# Altium project SPICEBot.PrjPcb
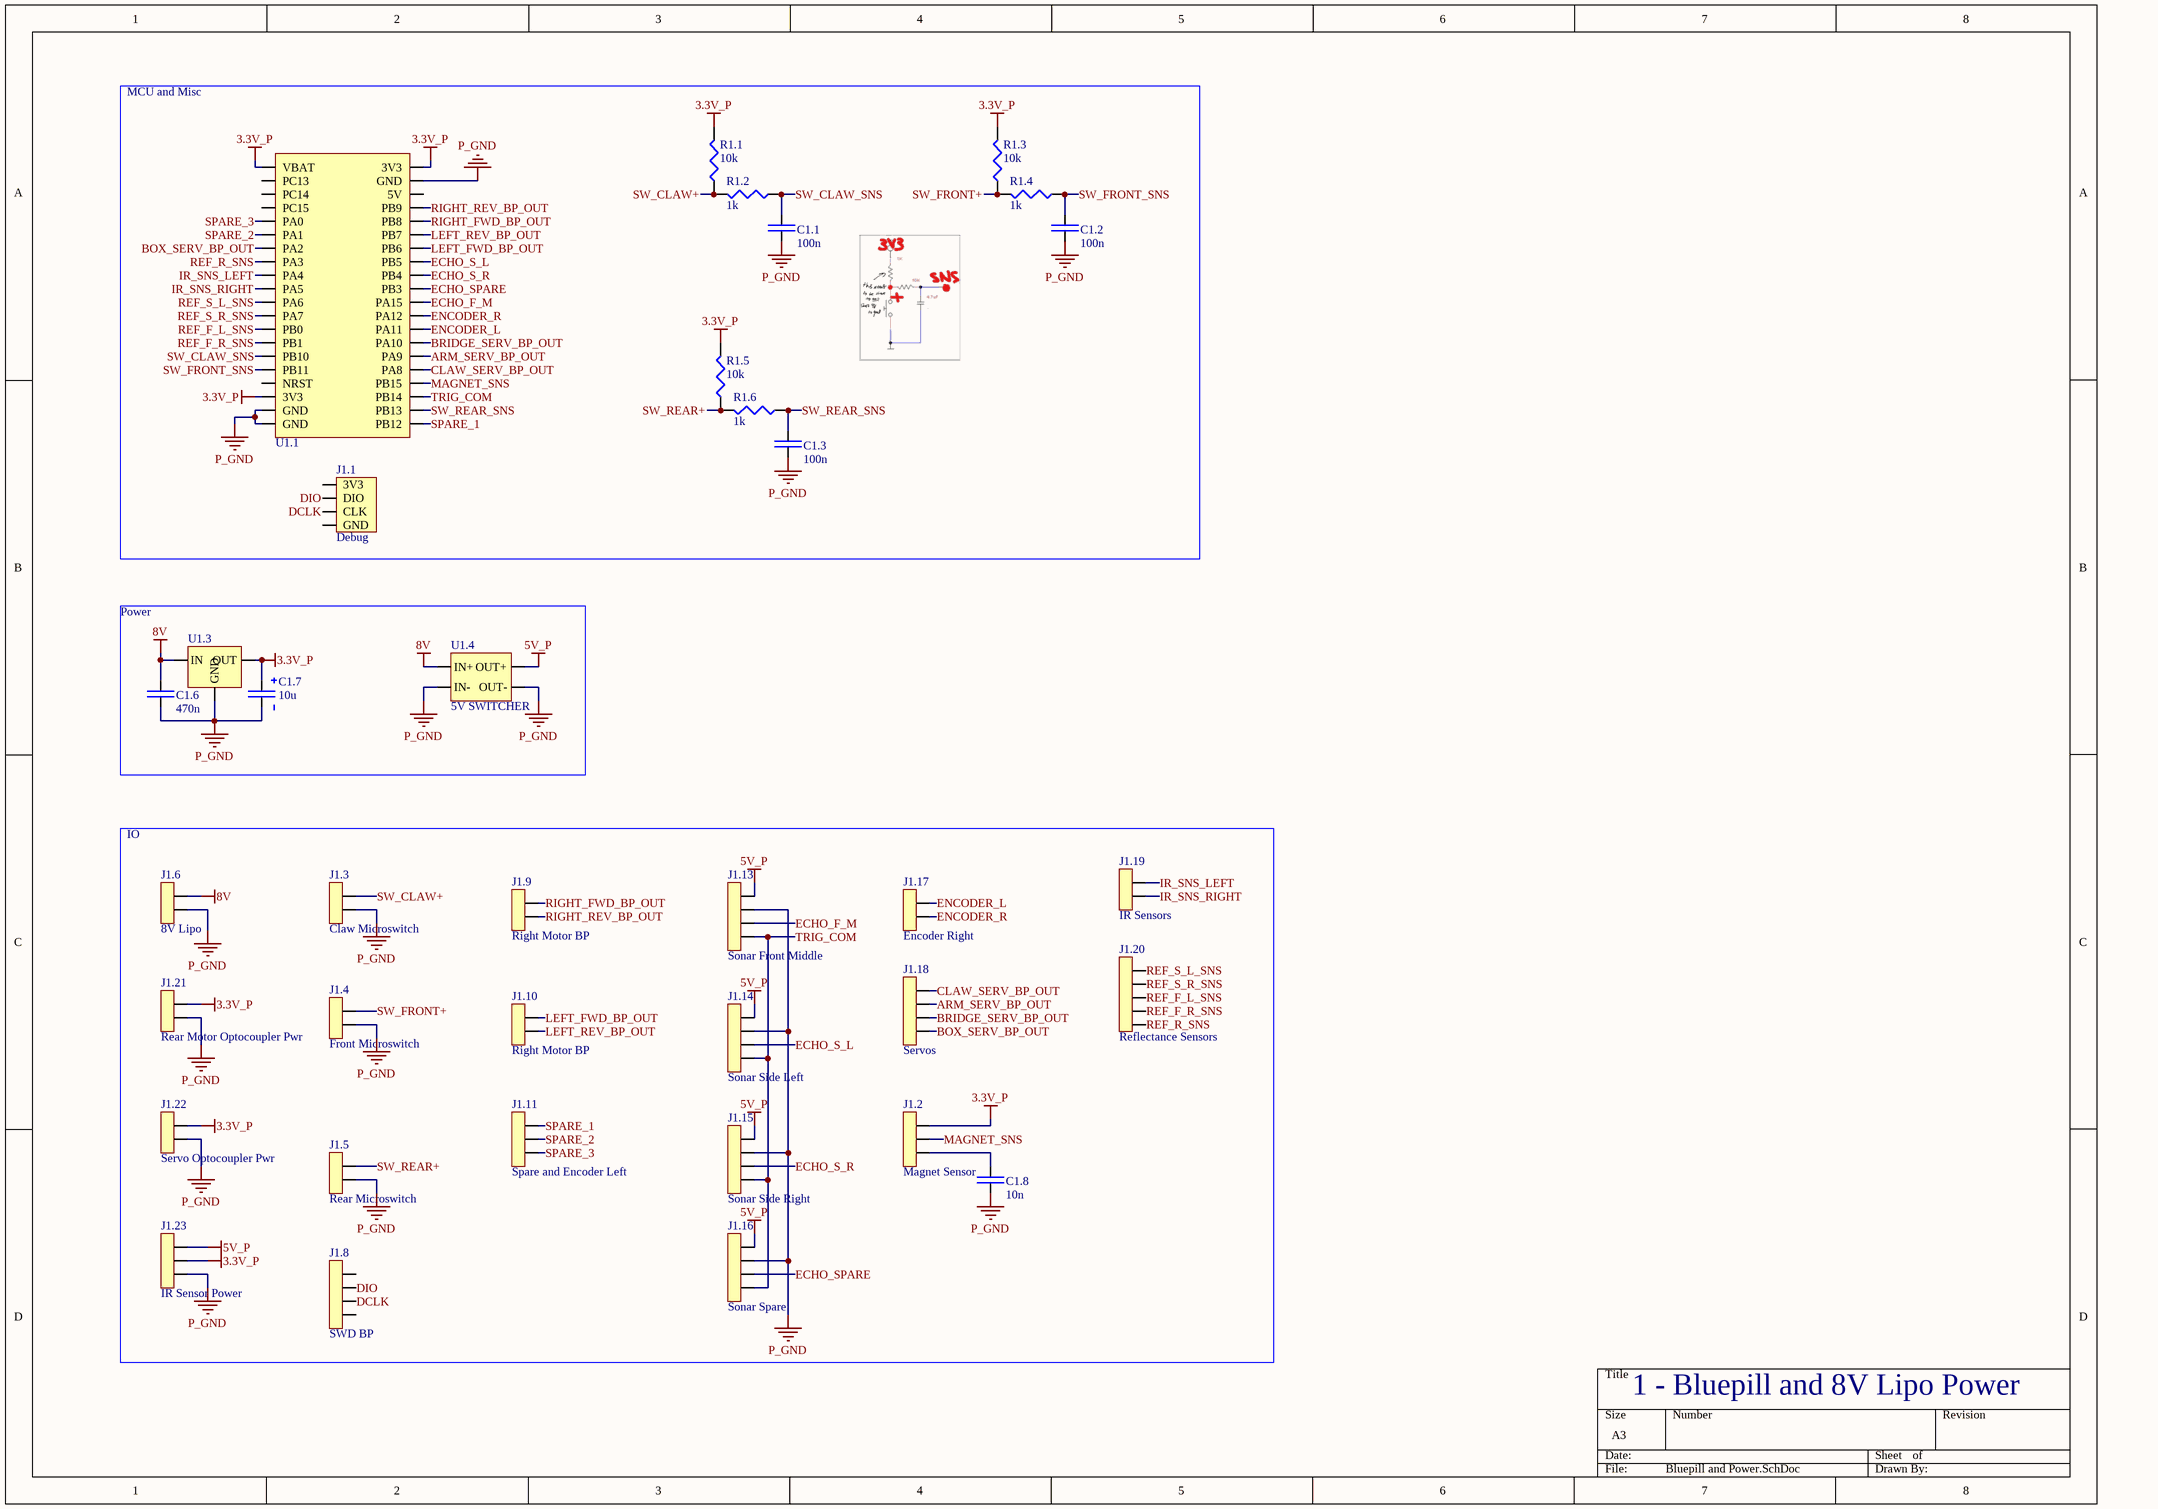
[diagram p0: Bluepill and Power.SchDoc]
9 sheets, 224 parts. Net scope: global (net labels, ports and power ports of the same name join across sheets).
Board files: BP.PcbDoc, IR Sensors.PcbDoc, Reflectance.PcbDoc, Rear Motors.PcbDoc, Servos.PcbDoc, Reflectance (Single).PcbDoc, Gate Driver Chip.PcbDoc, Motor Driver (Single).PcbDoc
Sheets:
  Bluepill and Power.SchDoc
  IR.SchDoc
  Reflectance.SchDoc
  Rear Motors.SchDoc
  Servos.SchDoc
  Reflectance (Single).SchDoc
  Gate Driver Chip.SchDoc
  Motor Driver (Single).SchDoc
  Servo Opto.SchDoc

## Sheet Bluepill and Power.SchDoc
size A3; SheetNumber: 1; SheetTotal: 9

### Parts
C1.1  100n  [Non Polarized Cap]
C1.2  100n  [Non Polarized Cap]
C1.3  100n  [Non Polarized Cap]
C1.6  470n  [Non Polarized Cap]
C1.7  10u  [Polarized Cap]
C1.8  10n  [Non Polarized Cap]
J1.1  Debug  [Four Pads]
J1.2  Magnet Sensor  [3pos JST]
J1.3  Claw Microswitch  [2pos JST]
J1.4  Front Microswitch  [2pos JST]
J1.5  Rear Microswitch  [2pos JST]
J1.6  8V Lipo  [2pos JST]
J1.8  SWD BP  [4Pos JST]
J1.9  Right Motor BP  [2pos JST]
J1.10  Right Motor BP  [2pos JST]
J1.11  Spare and Encoder Left  [3pos JST]
J1.13  Sonar Front Middle  [4Pos JST]
J1.14  Sonar Side Left  [4Pos JST]
J1.15  Sonar Side Right  [4Pos JST]
J1.16  Sonar Spare  [4Pos JST]
J1.17  Encoder Right  [2pos JST]
J1.18  Servos  [4Pos JST]
J1.19  IR Sensors  [2pos JST]
J1.20  Reflectance Sensors  [5POS JST]
J1.21  Rear Motor Optocoupler Pwr  [2pos JST]
J1.22  Servo Optocoupler Pwr  [2pos JST]
J1.23  IR Sensor Power  [3pos JST]
R1.1  10k  [Res_Generic]
R1.2  1k  [Res_Generic]
R1.3  10k  [Res_Generic]
R1.4  1k  [Res_Generic]
R1.5  10k  [Res_Generic]
R1.6  1k  [Res_Generic]
U1.1  Bluepill  [DIP40]  (value not drawn)
U1.3  3.3V  [TO220]  (value not drawn)
U1.4  5V SWITCHER  [ADJ Switcher]

### Blocks framed on the sheet
MCU and Misc: C1.1-C1.3 J1.1 R1.1-R1.6 U1.1
Power: C1.6 C1.7 U1.3 U1.4
IO: C1.8 J1.2-J1.6 J1.8-J1.11 J1.13-J1.23

### Nets
3.3V_P: C1.7.1 J1.2.3 J1.21.2 J1.22.2 J1.23.2 R1.1.2 R1.3.2 R1.5.2 U1.1.1(VBAT) U1.1.18(3V3) U1.1.40(3V3) U1.3.2(OUT)
5V_P: J1.13.4 J1.14.4 J1.15.4 J1.16.4 J1.23.3 U1.4.4(OUT+)
8V: C1.6.2 J1.6.2 U1.3.3(IN) U1.4.1(IN+)
P_GND: C1.1.1 C1.2.1 C1.3.1 C1.6.1 C1.7.2 C1.8.1 J1.3.1 J1.4.1 J1.5.1 J1.6.1 J1.13.3 J1.14.3 J1.15.3 J1.16.3 J1.21.1 J1.22.1 J1.23.1 U1.1.19(GND) U1.1.20(GND) U1.1.39(GND) U1.3.1(GND) U1.4.2(IN-) U1.4.3(OUT-)
ARM_SERV_BP_OUT: J1.18.3 U1.1.26(PA9)
BOX_SERV_BP_OUT: J1.18.1 U1.1.7(PA2)
BRIDGE_SERV_BP_OUT: J1.18.2 U1.1.27(PA10)
CLAW_SERV_BP_OUT: J1.18.4 U1.1.25(PA8)
DCLK: J1.1.3(CLK) J1.8.2
DIO: J1.1.2(DIO) J1.8.3
ECHO_F_M: J1.13.2 U1.1.30(PA15)
ECHO_S_L: J1.14.2 U1.1.33(PB5)
ECHO_S_R: J1.15.2 U1.1.32(PB4)
ECHO_SPARE: J1.16.2 U1.1.31(PB3)
ENCODER_L: J1.17.2 U1.1.28(PA11)
ENCODER_R: J1.17.1 U1.1.29(PA12)
IR_SNS_LEFT: J1.19.2 U1.1.9(PA4)
IR_SNS_RIGHT: J1.19.1 U1.1.10(PA5)
LEFT_FWD_BP_OUT: J1.10.2 U1.1.34(PB6)
LEFT_REV_BP_OUT: J1.10.1 U1.1.35(PB7)
MAGNET_SNS: J1.2.2 U1.1.24(PB15)
REF_F_L_SNS: J1.20.2 U1.1.13(PB0)
REF_F_R_SNS: J1.20.1 U1.1.14(PB1)
REF_R_SNS: J1.20.5 U1.1.8(PA3)
REF_S_L_SNS: J1.20.4 U1.1.11(PA6)
REF_S_R_SNS: J1.20.3 U1.1.12(PA7)
RIGHT_FWD_BP_OUT: J1.9.2 U1.1.36(PB8)
RIGHT_REV_BP_OUT: J1.9.1 U1.1.37(PB9)
SPARE_1: J1.11.3 U1.1.21(PB12)
SPARE_2: J1.11.2 U1.1.6(PA1)
SPARE_3: J1.11.1 U1.1.5(PA0)
SW_CLAW+: J1.3.2 R1.1.1 R1.2.2
SW_CLAW_SNS: C1.1.2 R1.2.1 U1.1.15(PB10)
SW_FRONT+: J1.4.2 R1.3.1 R1.4.2
SW_FRONT_SNS: C1.2.2 R1.4.1 U1.1.16(PB11)
SW_REAR+: J1.5.2 R1.5.1 R1.6.2
SW_REAR_SNS: C1.3.2 R1.6.1 U1.1.22(PB13)
TRIG_COM: J1.13.1 J1.14.1 J1.15.1 J1.16.1 U1.1.23(PB14)
NetC1.8_2: C1.8.2 J1.2.1

Not connected (* = marked no-connect by the designer): J1.1 1(3V3) 4(GND); J1.8 1 4; U1.1 2(PC13) 3(PC14) 4(PC15) 17(NRST) 38(5V)

### Notes on the sheet
- 1 - Bluepill and 8V Lipo Power

### Library data of the parts
C1.1-C1.3 C1.6 C1.8 = Cap_Generic
C1.7 = Polarized Cap
J1.1 = BP SWD Conn
J1.2 J1.11 J1.23 = 3pos Conn
J1.3-J1.6 J1.9 J1.10 J1.17 J1.19 J1.21 J1.22 = 2pos Conn: 2pos Conn JST
J1.8 J1.13-J1.16 J1.18 = 4pos Conn
J1.20 = 5pos Conn: 5pos Conn JST
R1.1-R1.6 = Res_Generic
U1.1 = Bluepill: STM32F103C8T6
U1.3 = MC33269 3.3V Reg: MC33269 IC REG LINEAR 3.3V 800MA TO220-3; Supplier 1: Mouser; Supplier Part Number 1: 595-UA78M33CKCS
U1.4 = LM2596S: Adjutable Switcher 3.5A Max

## Sheet IR.SchDoc
size A3; SheetNumber: 2; SheetTotal: 8
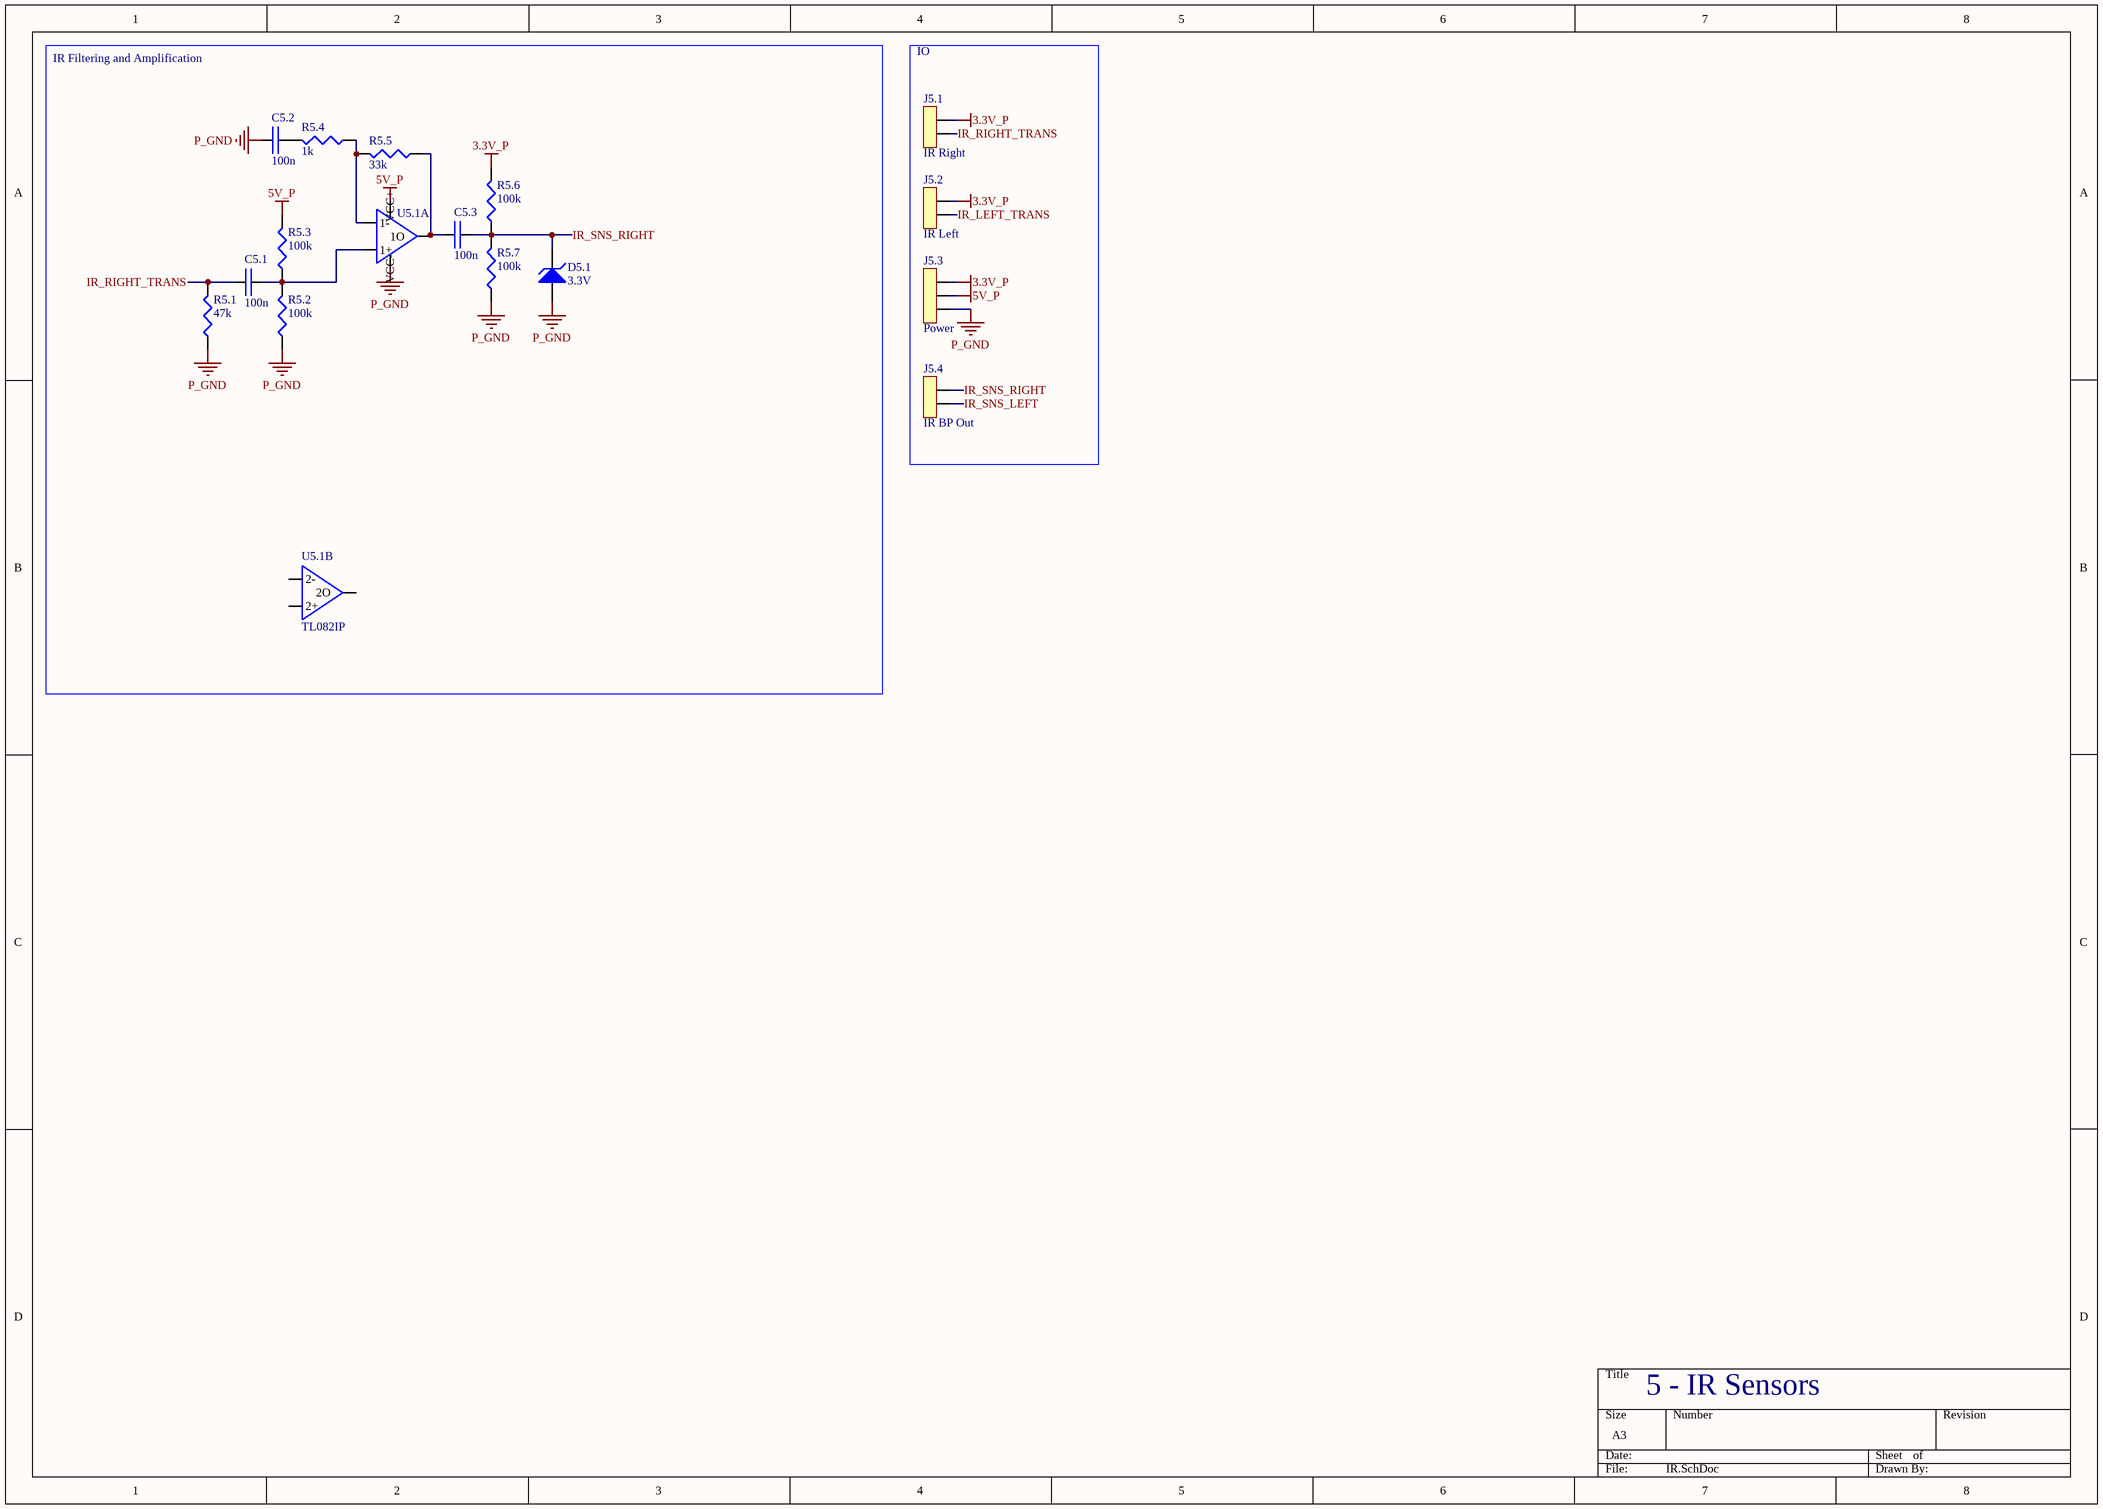
[diagram p1: IR.SchDoc]

### Parts
C5.1  100n  [Non Polarized Cap]
C5.2  100n  [Non Polarized Cap]
C5.3  100n  [Non Polarized Cap]
D5.1  3.3V  [Zener Generic]
J5.1  IR Right  [2pos JST]
J5.2  IR Left  [2pos JST]
J5.3  Power  [3pos JST]
J5.4  IR BP Out  [2pos JST]
R5.1  47k  [Res_Generic]
R5.2  100k  [Res_Generic]
R5.3  100k  [Res_Generic]
R5.4  1k  [Res_Generic]
R5.5  33k  [Res_Generic]
R5.6  100k  [Res_Generic]
R5.7  100k  [Res_Generic]
U5.1  TL082IP  [DIP8]  (value not drawn)  (parts A,B of 2)

### Blocks framed on the sheet
IR Filtering and Amplification: C5.1-C5.3 D5.1 R5.1-R5.7 U5.1
IO: J5.1-J5.4

### Nets
3.3V_P: J5.1.2 J5.2.2 J5.3.3 R5.6.2
5V_P: J5.3.2 R5.3.2 U5.1.8(VCC+)
P_GND: C5.2.1 D5.1.1(Anode) J5.3.1 R5.1.1 R5.2.1 R5.7.1 U5.1.4(VCC-)
IR_LEFT_TRANS: J5.2.1
IR_RIGHT_TRANS: C5.1.1 J5.1.1 R5.1.2
IR_SNS_LEFT: J5.4.1
IR_SNS_RIGHT: C5.3.2 D5.1.2(Cathode) J5.4.2 R5.6.1 R5.7.2
NetC5.1_2: C5.1.2 R5.2.2 R5.3.1 U5.1.3(1+)
NetC5.2_2: C5.2.2 R5.4.2
NetC5.3_1: C5.3.1 R5.5.1 U5.1.1(1O)
NetR5.4_1: R5.4.1 R5.5.2 U5.1.2(1-)

Not connected (* = marked no-connect by the designer): U5.1 5(2+) 6(2-) 7(2O)

### Notes on the sheet
- 5 - IR Sensors

### Library data of the parts
C5.1-C5.3 = Cap_Generic
D5.1 = Zener_Generic
J5.1 J5.2 J5.4 = 2pos Conn: 2pos Conn JST
J5.3 = 3pos Conn
R5.1-R5.7 = Res_Generic
U5.1 = TL082IP Op Amp: TL082IP IC OPAMP JFET 2 CIRCUIT 8DIP; Supplier 1: Mouser; Supplier Part Number 1: 595-TL082IP

## Sheet Reflectance.SchDoc
size A3; SheetNumber: 3; SheetTotal: 9
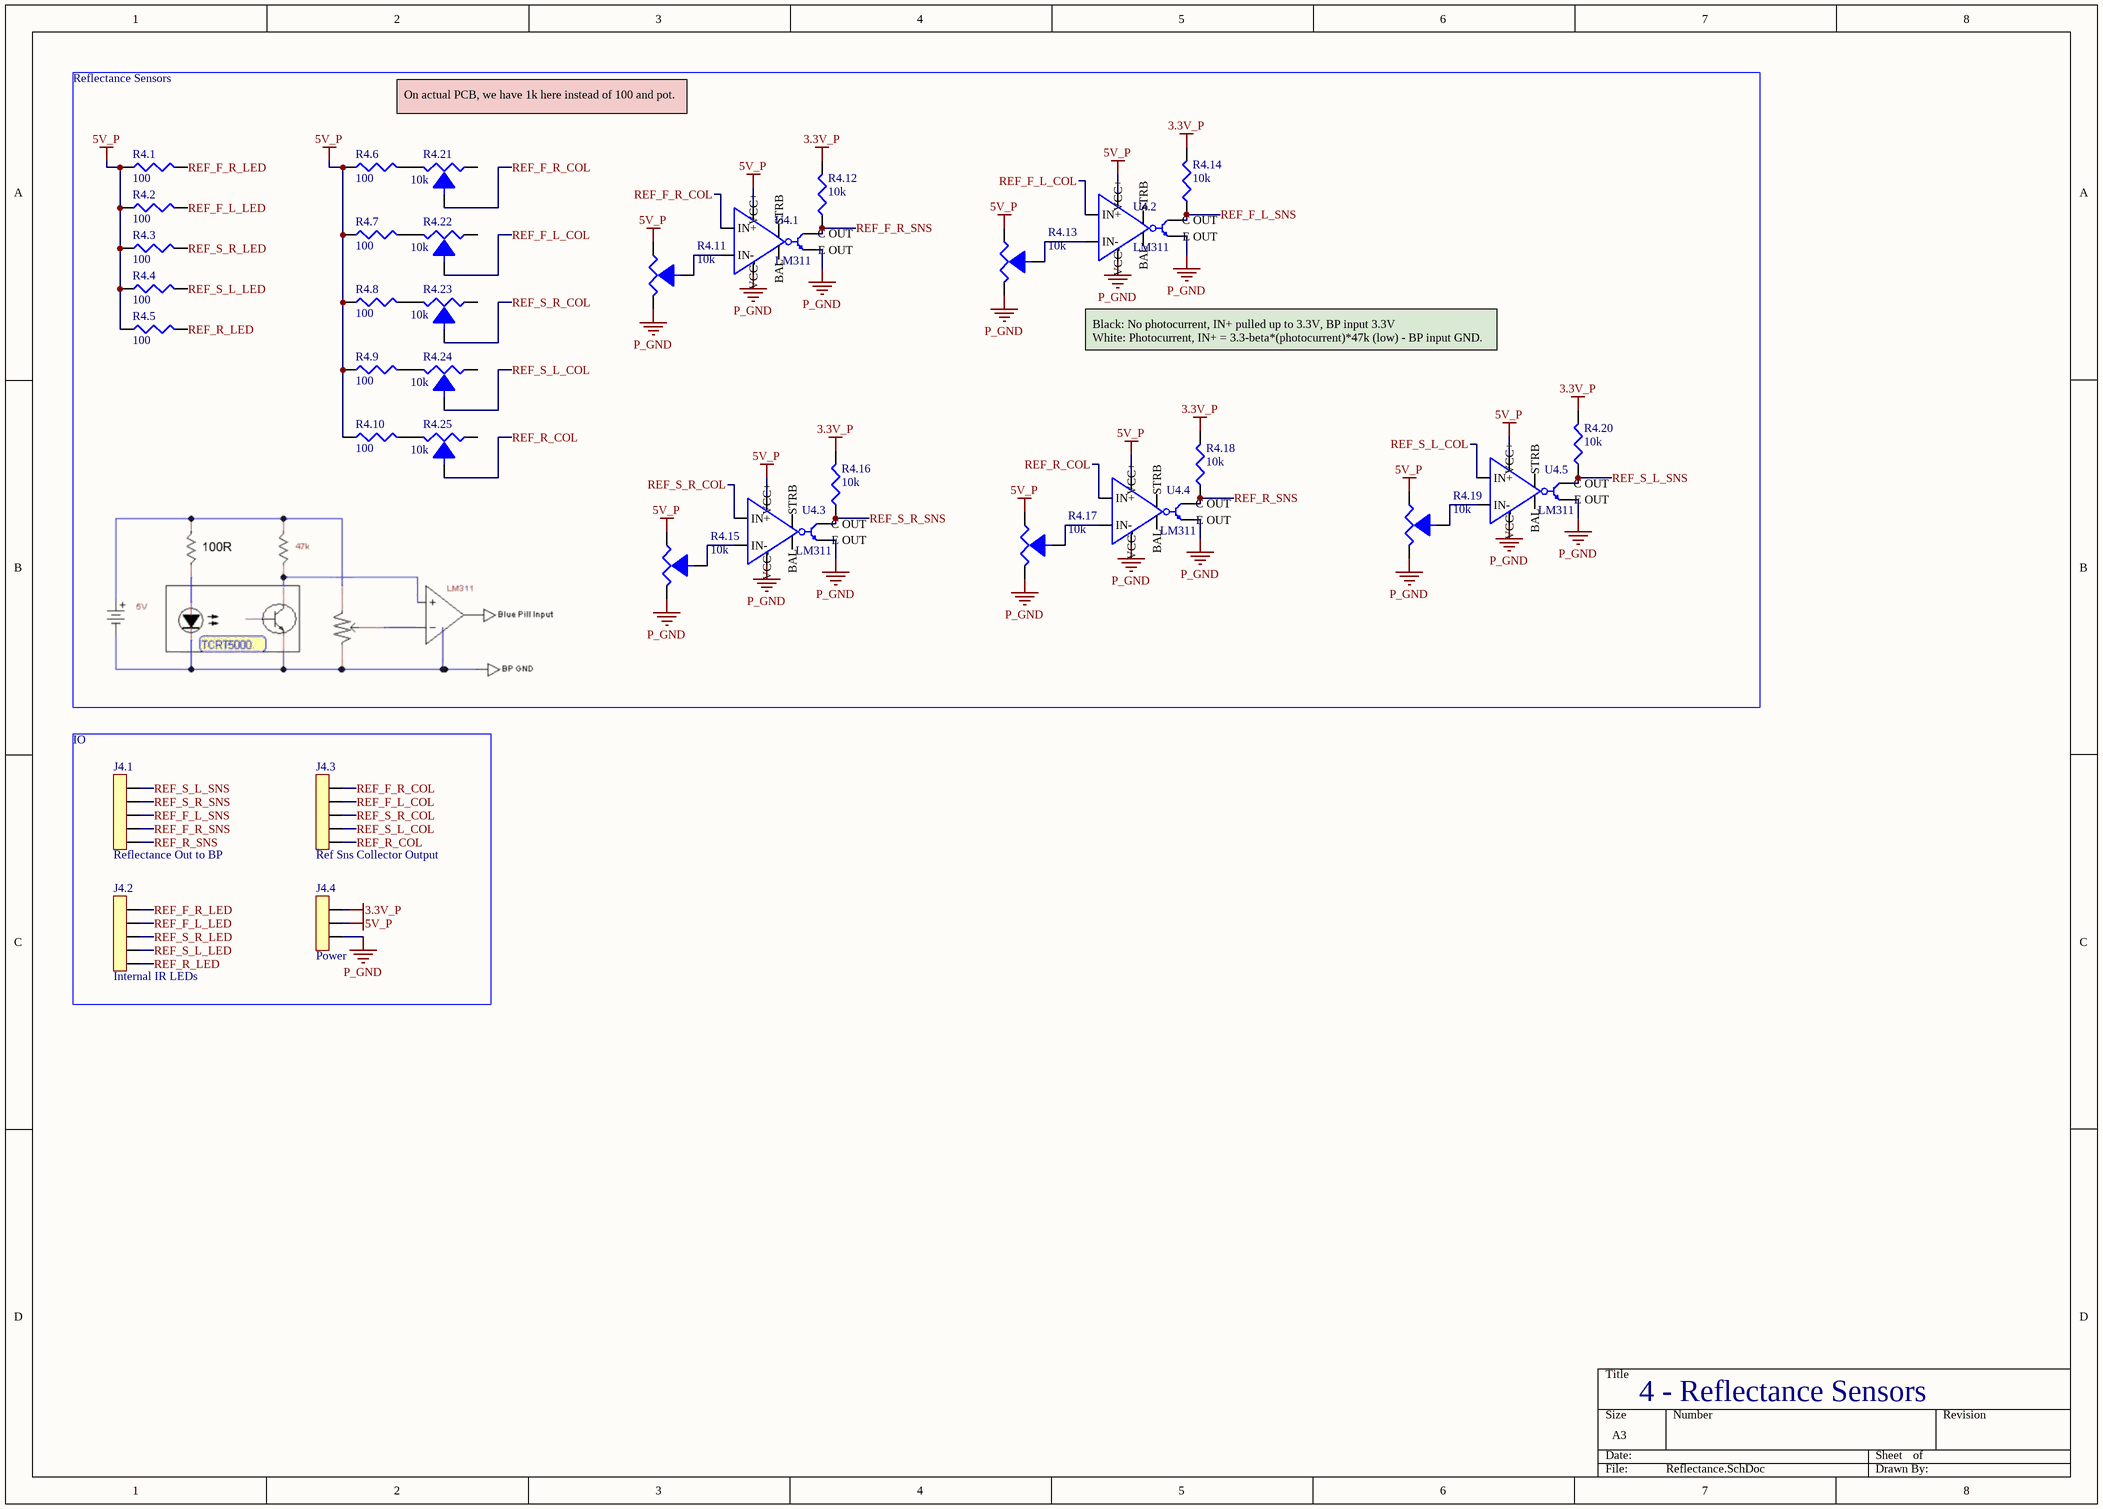
[diagram p2: Reflectance.SchDoc]

### Parts
J4.1  Reflectance Out to BP  [5POS JST]
J4.2  Internal IR LEDs  [5POS JST]
J4.3  Ref Sns Collector Output  [5POS JST]
J4.4  Power  [3pos JST]
R4.1  100  [Res_Generic]
R4.2  100  [Res_Generic]
R4.3  100  [Res_Generic]
R4.4  100  [Res_Generic]
R4.5  100  [Res_Generic]
R4.6  100  [Res_Generic]
R4.7  100  [Res_Generic]
R4.8  100  [Res_Generic]
R4.9  100  [Res_Generic]
R4.10  100  [Res_Generic]
R4.11  10k  [Pot Generic]
R4.12  10k  [Res_Generic]
R4.13  10k  [Pot Generic]
R4.14  10k  [Res_Generic]
R4.15  10k  [Pot Generic]
R4.16  10k  [Res_Generic]
R4.17  10k  [Pot Generic]
R4.18  10k  [Res_Generic]
R4.19  10k  [Pot Generic]
R4.20  10k  [Res_Generic]
R4.21  10k  [Pot Generic]
R4.22  10k  [Pot Generic]
R4.23  10k  [Pot Generic]
R4.24  10k  [Pot Generic]
R4.25  10k  [Pot Generic]
U4.1  LM311  [DIP8]
U4.2  LM311  [DIP8]
U4.3  LM311  [DIP8]
U4.4  LM311  [DIP8]
U4.5  LM311  [DIP8]

### Blocks framed on the sheet
Reflectance Sensors: R4.1-R4.25 U4.1-U4.5
IO: J4.1-J4.4

### Nets
3.3V_P: J4.4.3 R4.12.2 R4.14.2 R4.16.2 R4.18.2 R4.20.2
5V_P: J4.4.2 R4.1.1 R4.2.1 R4.3.1 R4.4.1 R4.5.1 R4.6.1 R4.7.1 R4.8.1 R4.9.1 R4.10.1 R4.11.3 R4.13.3 R4.15.3 R4.17.3 R4.19.3 U4.1.8(VCC+) U4.2.8(VCC+) U4.3.8(VCC+) U4.4.8(VCC+) U4.5.8(VCC+)
P_GND: J4.4.1 R4.11.1 R4.13.1 R4.15.1 R4.17.1 R4.19.1 U4.1.1(E_OUT) U4.1.4(VCC-) U4.2.1(E_OUT) U4.2.4(VCC-) U4.3.1(E_OUT) U4.3.4(VCC-) U4.4.1(E_OUT) U4.4.4(VCC-) U4.5.1(E_OUT) U4.5.4(VCC-)
REF_F_L_COL: J4.3.3 R4.22.2 U4.2.2(IN+)
REF_F_L_LED: J4.2.3 R4.2.2
REF_F_L_SNS: J4.1.2 R4.14.1 U4.2.7(C_OUT)
REF_F_R_COL: J4.3.4 R4.21.2 U4.1.2(IN+)
REF_F_R_LED: J4.2.4 R4.1.2
REF_F_R_SNS: J4.1.1 R4.12.1 U4.1.7(C_OUT)
REF_R_COL: J4.3.5 R4.25.2 U4.4.2(IN+)
REF_R_LED: J4.2.5 R4.5.2
REF_R_SNS: J4.1.5 R4.18.1 U4.4.7(C_OUT)
REF_S_L_COL: J4.3.1 R4.24.2 U4.5.2(IN+)
REF_S_L_LED: J4.2.1 R4.4.2
REF_S_L_SNS: J4.1.4 R4.20.1 U4.5.7(C_OUT)
REF_S_R_COL: J4.3.2 R4.23.2 U4.3.2(IN+)
REF_S_R_LED: J4.2.2 R4.3.2
REF_S_R_SNS: J4.1.3 R4.16.1 U4.3.7(C_OUT)
NetR4.6_2: R4.6.2 R4.21.1
NetR4.7_2: R4.7.2 R4.22.1
NetR4.8_2: R4.8.2 R4.23.1
NetR4.9_2: R4.9.2 R4.24.1
NetR4.10_2: R4.10.2 R4.25.1
NetR4.11_2: R4.11.2 U4.1.3(IN-)
NetR4.13_2: R4.13.2 U4.2.3(IN-)
NetR4.15_2: R4.15.2 U4.3.3(IN-)
NetR4.17_2: R4.17.2 U4.4.3(IN-)
NetR4.19_2: R4.19.2 U4.5.3(IN-)

Not connected (* = marked no-connect by the designer): R4.21 3; R4.22 3; R4.23 3; R4.24 3; R4.25 3; U4.1 5(BAL) 6(STRB); U4.2 5(BAL) 6(STRB); U4.3 5(BAL) 6(STRB); U4.4 5(BAL) 6(STRB); U4.5 5(BAL) 6(STRB)

### Notes on the sheet
- On actual PCB, we have 1k here instead of 100 and pot.
- Black: No photocurrent, IN+ pulled up to 3.3V, BP input 3.3V
  White: Photocurrent, IN+ = 3.3-beta*(photocurrent)*47k (low) - BP input GND.
- 4 - Reflectance Sensors

### Library data of the parts
J4.1-J4.3 = 5pos Conn: 5pos Conn JST
J4.4 = 3pos Conn
R4.1-R4.10 R4.12 R4.14 R4.16 R4.18 R4.20 = Res_Generic
R4.11 R4.13 R4.15 R4.17 R4.19 R4.21-R4.25 = Pot_Generic
U4.1-U4.5 = LM311 Comparator: LM311 IC DIFF COMPARATOR STROBE 8-DIP; Supplier 1: Mouser; Supplier Part Number 1: 595-LM311P

## Sheet Rear Motors.SchDoc
size A3; SheetNumber: 4; SheetTotal: 8
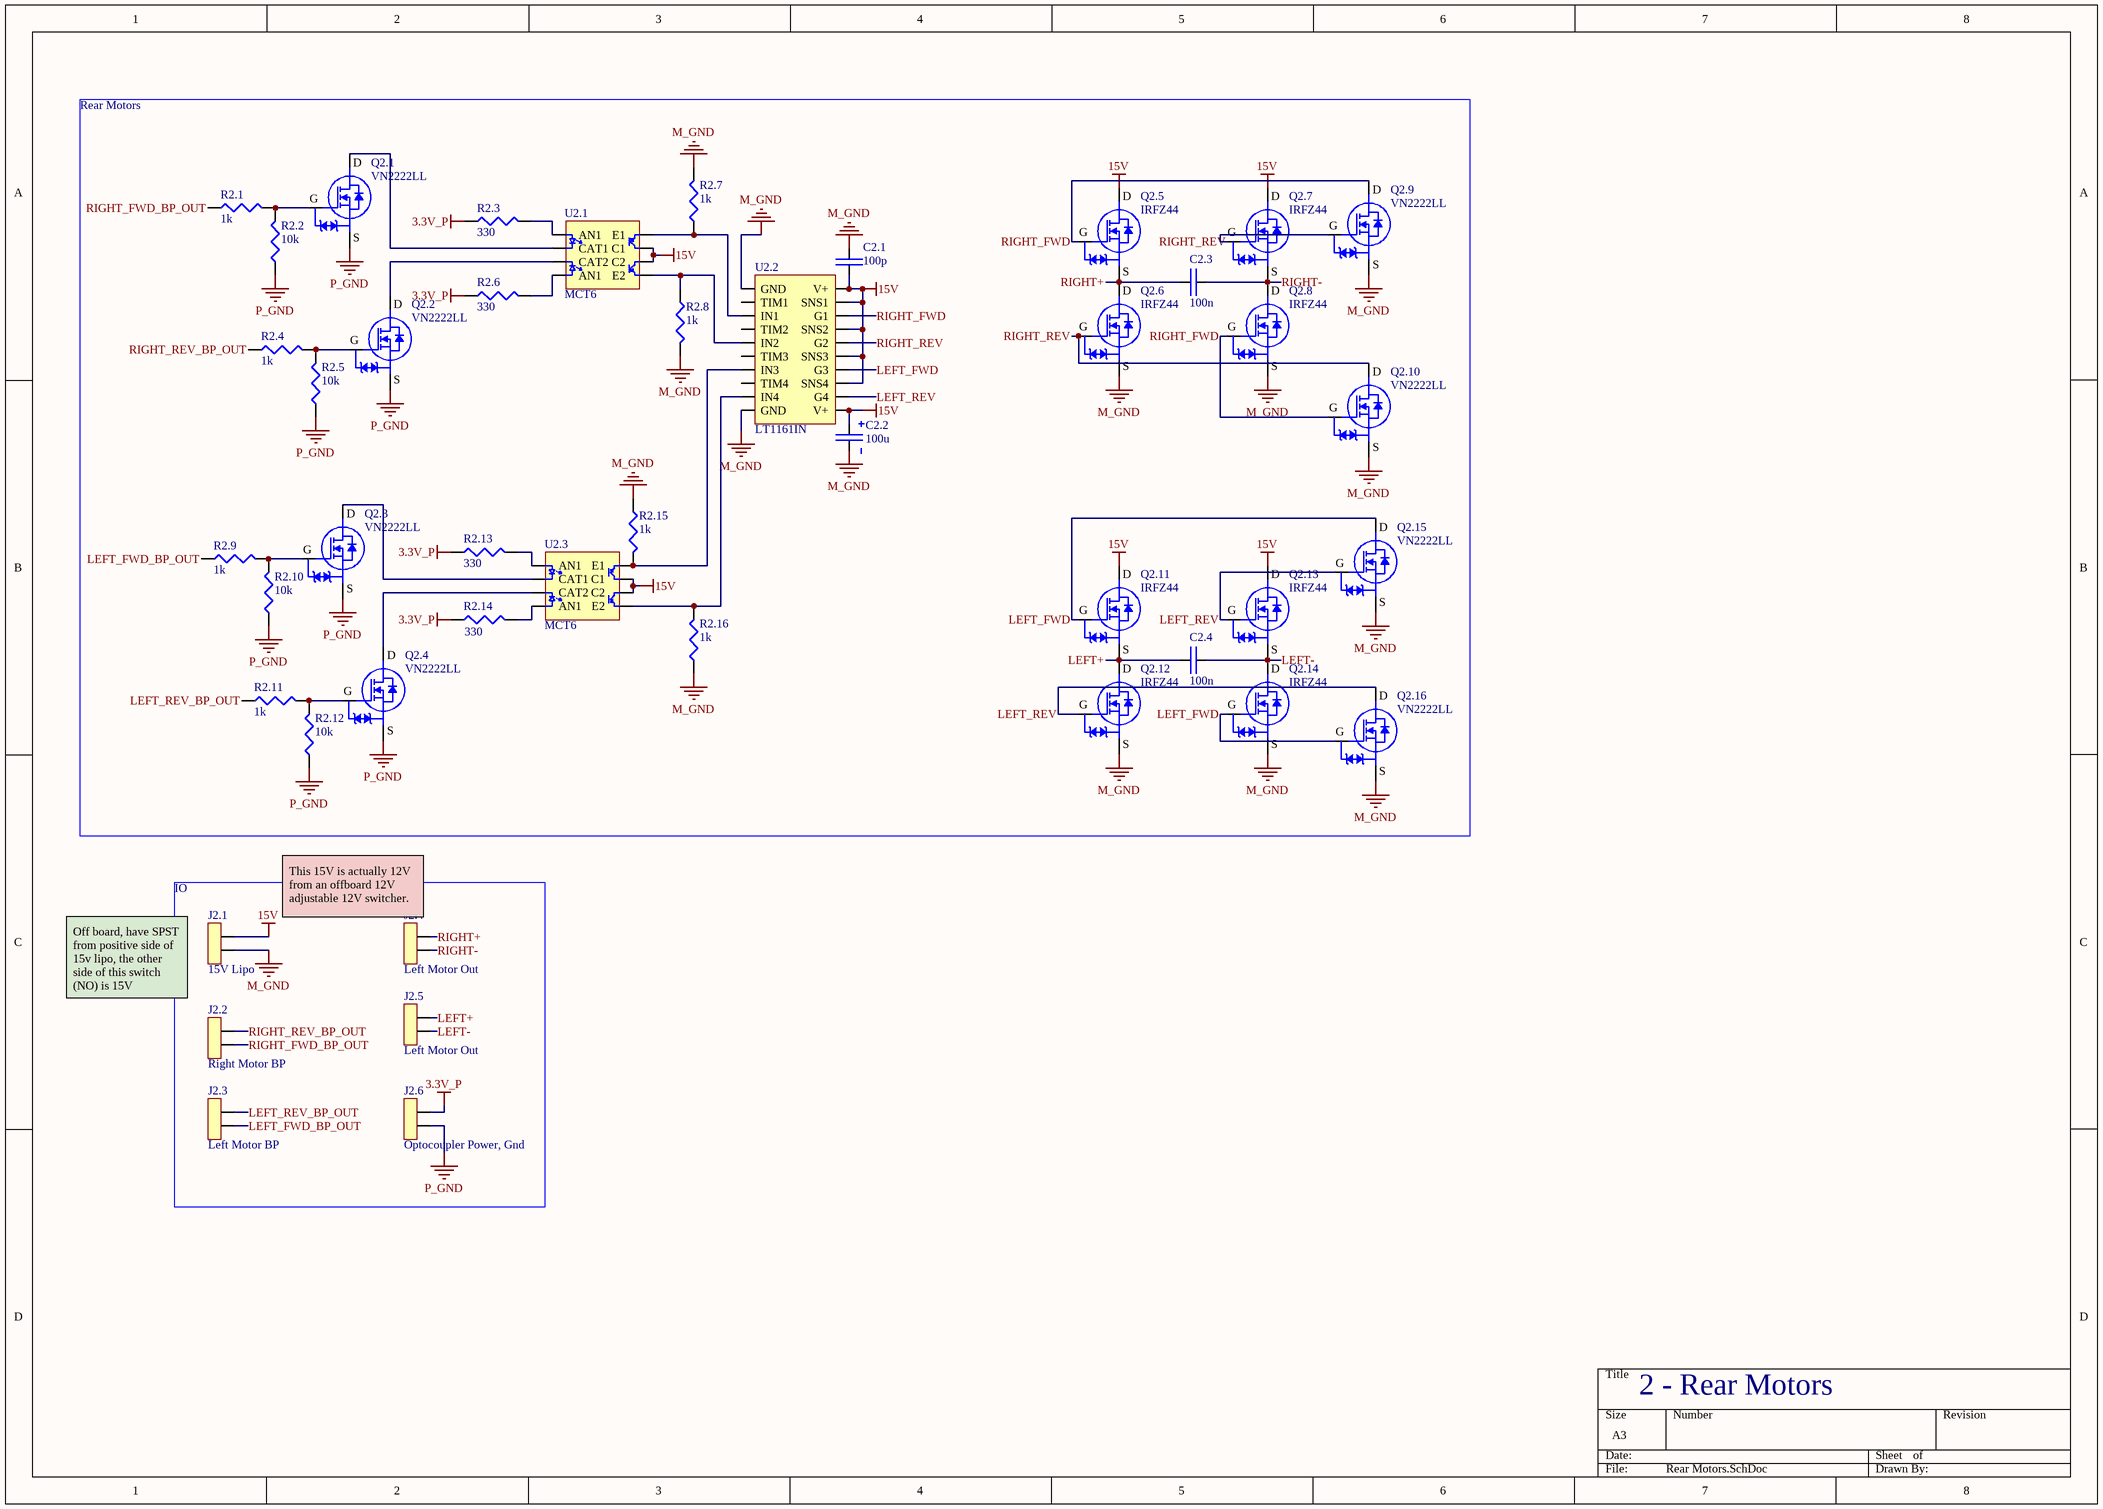
[diagram p3: Rear Motors.SchDoc]

### Parts
C2.1  100p  [Non Polarized Cap]
C2.2  100u  [Polarized Cap]
C2.3  100n  [Non Polarized Cap]
C2.4  100n  [Non Polarized Cap]
J2.1  15V Lipo  [2pos JST]
J2.2  Right Motor BP  [2pos JST]
J2.3  Left Motor BP  [2pos JST]
J2.4  Left Motor Out  [2pos JST]
J2.5  Left Motor Out  [2pos JST]
J2.6  Optocoupler Power, Gnd  [2pos JST]
Q2.1  VN2222LL  [VN2222LL]
Q2.2  VN2222LL  [VN2222LL]
Q2.3  VN2222LL  [VN2222LL]
Q2.4  VN2222LL  [VN2222LL]
Q2.5  IRFZ44  [TO220]
Q2.6  IRFZ44  [TO220]
Q2.7  IRFZ44  [TO220]
Q2.8  IRFZ44  [TO220]
Q2.9  VN2222LL  [VN2222LL]
Q2.10  VN2222LL  [VN2222LL]
Q2.11  IRFZ44  [TO220]
Q2.12  IRFZ44  [TO220]
Q2.13  IRFZ44  [TO220]
Q2.14  IRFZ44  [TO220]
Q2.15  VN2222LL  [VN2222LL]
Q2.16  VN2222LL  [VN2222LL]
R2.1  1k  [Res_Generic]
R2.2  10k  [Res_Generic]
R2.3  330  [Res_Generic]
R2.4  1k  [Res_Generic]
R2.5  10k  [Res_Generic]
R2.6  330  [Res_Generic]
R2.7  1k  [Res_Generic]
R2.8  1k  [Res_Generic]
R2.9  1k  [Res_Generic]
R2.10  10k  [Res_Generic]
R2.11  1k  [Res_Generic]
R2.12  10k  [Res_Generic]
R2.13  330  [Res_Generic]
R2.14  330  [Res_Generic]
R2.15  1k  [Res_Generic]
R2.16  1k  [Res_Generic]
U2.1  MCT6  [DIP8]
U2.2  LT1161IN  [DIP20]
U2.3  MCT6  [DIP8]

### Blocks framed on the sheet
Rear Motors: C2.1-C2.4 Q2.1-Q2.16 R2.1-R2.16 U2.1-U2.3
IO: J2.1-J2.6

### Nets
3.3V_P: J2.6.2 R2.3.1 R2.6.1 R2.13.1 R2.14.1
15V: C2.1.1 C2.2.1 J2.1.2 Q2.5.2(D) Q2.7.2(D) Q2.11.2(D) Q2.13.2(D) U2.1.6(C2) U2.1.7(C1) U2.2.11(V+) U2.2.13(SNS4) U2.2.15(SNS3) U2.2.17(SNS2) U2.2.19(SNS1) U2.2.20(V+) U2.3.6(C2) U2.3.7(C1)
M_GND: C2.1.2 C2.2.2 J2.1.1 Q2.6.3(S) Q2.8.3(S) Q2.9.1(S) Q2.10.1(S) Q2.12.3(S) Q2.14.3(S) Q2.15.1(S) Q2.16.1(S) R2.7.2 R2.8.2 R2.15.1 R2.16.1 U2.2.1(GND) U2.2.10(GND)
P_GND: J2.6.1 Q2.1.1(S) Q2.2.1(S) Q2.3.1(S) Q2.4.1(S) R2.2.1 R2.5.1 R2.10.1 R2.12.1
LEFT+: C2.4.1 J2.5.2 Q2.11.3(S) Q2.12.2(D)
LEFT-: C2.4.2 J2.5.1 Q2.13.3(S) Q2.14.2(D)
LEFT_FWD: Q2.11.1(G) Q2.14.1(G) Q2.15.3(D) Q2.16.2(G) U2.2.14(G3)
LEFT_FWD_BP_OUT: J2.3.1 R2.9.1
LEFT_REV: Q2.12.1(G) Q2.13.1(G) Q2.15.2(G) Q2.16.3(D) U2.2.12(G4)
LEFT_REV_BP_OUT: J2.3.2 R2.11.1
RIGHT+: C2.3.1 J2.4.2 Q2.5.3(S) Q2.6.2(D)
RIGHT-: C2.3.2 J2.4.1 Q2.7.3(S) Q2.8.2(D)
RIGHT_FWD: Q2.5.1(G) Q2.8.1(G) Q2.9.3(D) Q2.10.2(G) U2.2.18(G1)
RIGHT_FWD_BP_OUT: J2.2.1 R2.1.1
RIGHT_REV: Q2.6.1(G) Q2.7.1(G) Q2.9.2(G) Q2.10.3(D) U2.2.16(G2)
RIGHT_REV_BP_OUT: J2.2.2 R2.4.1
NetQ2.1_2: Q2.1.2(G) R2.1.2 R2.2.2
NetQ2.1_3: Q2.1.3(D) U2.1.2(CAT1)
NetQ2.2_2: Q2.2.2(G) R2.4.2 R2.5.2
NetQ2.2_3: Q2.2.3(D) U2.1.3(CAT2)
NetQ2.3_2: Q2.3.2(G) R2.9.2 R2.10.2
NetQ2.3_3: Q2.3.3(D) U2.3.2(CAT1)
NetQ2.4_2: Q2.4.2(G) R2.11.2 R2.12.2
NetQ2.4_3: Q2.4.3(D) U2.3.3(CAT2)
NetR2.3_2: R2.3.2 U2.1.1(AN1)
NetR2.6_2: R2.6.2 U2.1.4(AN1)
NetR2.7_1: R2.7.1 U2.1.8(E1) U2.2.3(IN1)
NetR2.8_1: R2.8.1 U2.1.5(E2) U2.2.5(IN2)
NetR2.13_2: R2.13.2 U2.3.1(AN1)
NetR2.14_2: R2.14.2 U2.3.4(AN1)
NetR2.15_2: R2.15.2 U2.2.7(IN3) U2.3.8(E1)
NetR2.16_2: R2.16.2 U2.2.9(IN4) U2.3.5(E2)

Not connected (* = marked no-connect by the designer): U2.2 2(TIM1) 4(TIM2) 6(TIM3) 8(TIM4)

### Notes on the sheet
- (near J2.4) This 15V is actually 12V from an offboard 12V adjustable 12V switcher.
- Off board, have SPST from positive side of 15v lipo, the other side of this switch (NO) is 15V
- 2 - Rear Motors

### Library data of the parts
C2.1 C2.3 C2.4 = Cap_Generic
C2.2 = Polarized Cap
J2.1-J2.6 = 2pos Conn: 2pos Conn JST
Q2.1-Q2.4 Q2.9 Q2.10 Q2.15 Q2.16 = VN2222LL NMOS: VN2222LL N-Channel 60 V 150mA 400mW Through Hole TO-92 (TO-226); Supplier 1: Mouser; Supplier Part Number 1: 689-VN2222LL-G
Q2.5-Q2.8 Q2.11-Q2.14 = IRFZ44 NMOS: IRFZ44EPBF N-Channel 60 V 48A 110W Through Hole TO-220AB; Supplier 1: Digi-Key; Supplier Part Number 1: IRFZ44ZLPBF-ND
R2.1-R2.16 = Res_Generic
U2.1 U2.3 = MCT6 Optocoupler: Optoisolator 5.3KV 2CH TRANS 8-DIP; Supplier 1: Mouser; Supplier Part Number 1: 512-MCT6
U2.2 = LT1161IN Gate Driver: LT1161IN High-Side Gate Driver IC Non-Inverting 20-PDIP; Supplier 1: Digi-Key; Supplier Part Number 1: LT1161IN#PBF-ND

## Sheet Servos.SchDoc
size A3; SheetNumber: 5; SheetTotal: 9
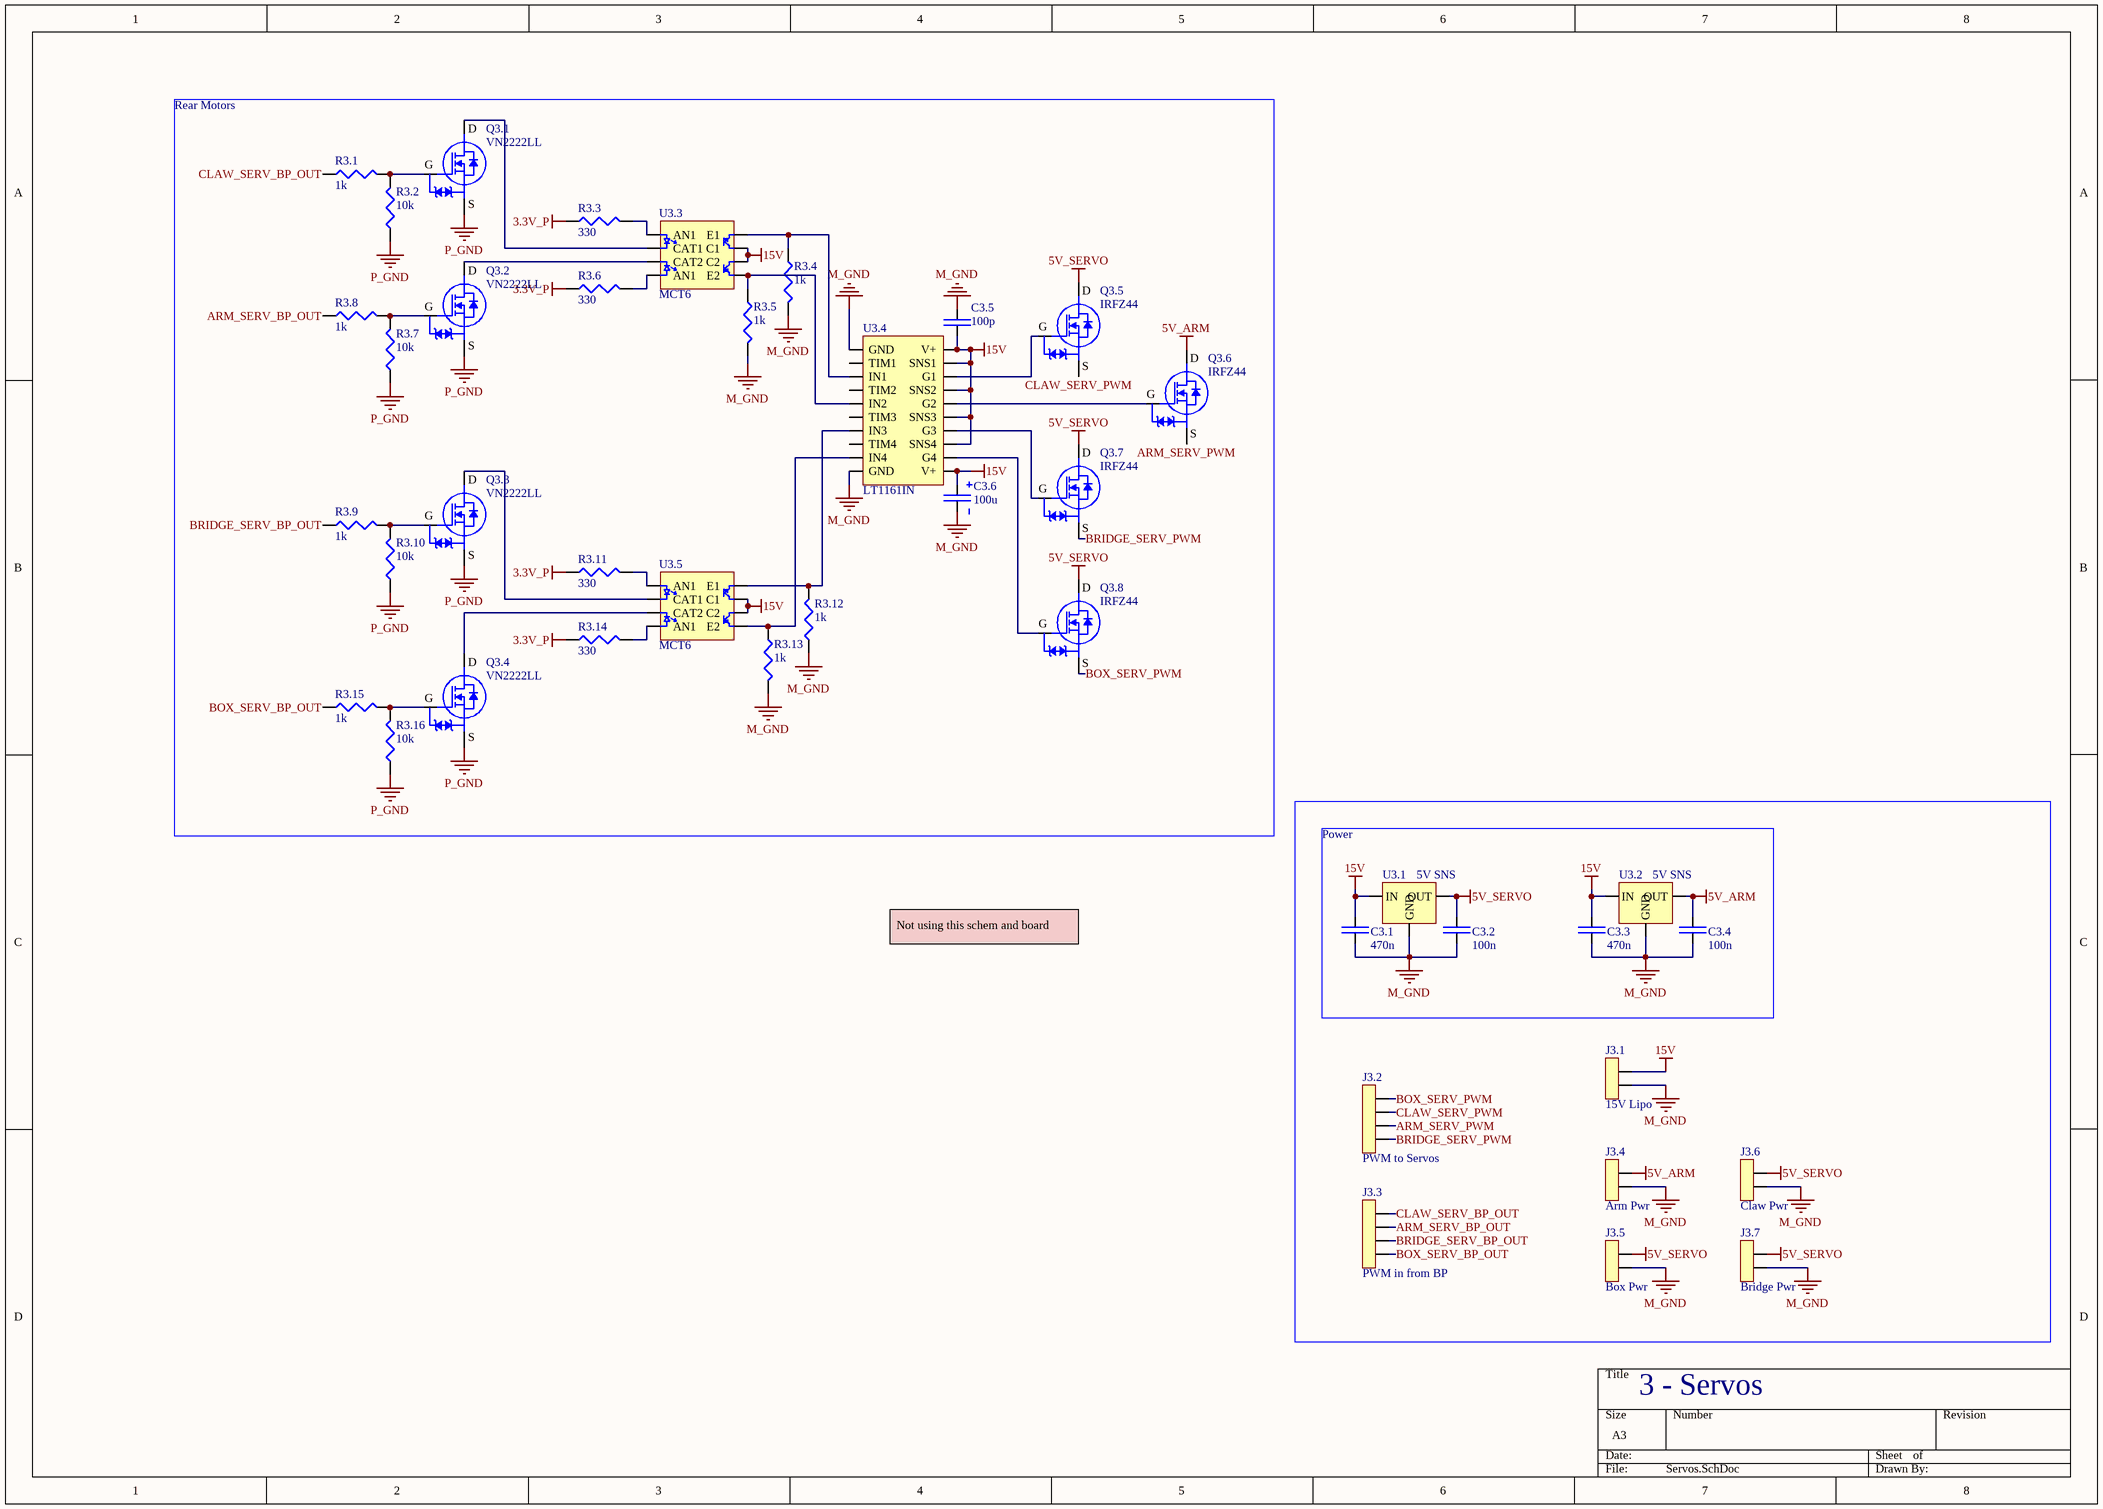
[diagram p4: Servos.SchDoc]

### Parts
C3.1  470n  [Non Polarized Cap]
C3.2  100n  [Non Polarized Cap]
C3.3  470n  [Non Polarized Cap]
C3.4  100n  [Non Polarized Cap]
C3.5  100p  [Non Polarized Cap]
C3.6  100u  [Polarized Cap]
J3.1  15V Lipo  [2pos JST]
J3.2  PWM to Servos  [4Pos JST]
J3.3  PWM in from BP  [4Pos JST]
J3.4  Arm Pwr  [2pos JST]
J3.5  Box Pwr  [2pos JST]
J3.6  Claw Pwr  [2pos JST]
J3.7  Bridge Pwr  [2pos JST]
Q3.1  VN2222LL  [VN2222LL]
Q3.2  VN2222LL  [VN2222LL]
Q3.3  VN2222LL  [VN2222LL]
Q3.4  VN2222LL  [VN2222LL]
Q3.5  IRFZ44  [TO220]
Q3.6  IRFZ44  [TO220]
Q3.7  IRFZ44  [TO220]
Q3.8  IRFZ44  [TO220]
R3.1  1k  [Res_Generic]
R3.2  10k  [Res_Generic]
R3.3  330  [Res_Generic]
R3.4  1k  [Res_Generic]
R3.5  1k  [Res_Generic]
R3.6  330  [Res_Generic]
R3.7  10k  [Res_Generic]
R3.8  1k  [Res_Generic]
R3.9  1k  [Res_Generic]
R3.10  10k  [Res_Generic]
R3.11  330  [Res_Generic]
R3.12  1k  [Res_Generic]
R3.13  1k  [Res_Generic]
R3.14  330  [Res_Generic]
R3.15  1k  [Res_Generic]
R3.16  10k  [Res_Generic]
U3.1  5V SNS  [TO220]
U3.2  5V SNS  [TO220]
U3.3  MCT6  [DIP8]
U3.4  LT1161IN  [DIP20]
U3.5  MCT6  [DIP8]

### Blocks framed on the sheet
Rear Motors: C3.5 C3.6 Q3.1-Q3.8 R3.1-R3.16 U3.3-U3.5
Power: C3.1-C3.4 U3.1 U3.2

### Nets
3.3V_P: R3.3.1 R3.6.1 R3.11.1 R3.14.1
5V_ARM: C3.4.2 J3.4.2 Q3.6.2(D) U3.2.3(OUT)
5V_SERVO: C3.2.2 J3.5.2 J3.6.2 J3.7.2 Q3.5.2(D) Q3.7.2(D) Q3.8.2(D) U3.1.3(OUT)
15V: C3.1.2 C3.3.2 C3.5.1 C3.6.1 J3.1.2 U3.1.1(IN) U3.2.1(IN) U3.3.6(C2) U3.3.7(C1) U3.4.11(V+) U3.4.13(SNS4) U3.4.15(SNS3) U3.4.17(SNS2) U3.4.19(SNS1) U3.4.20(V+) U3.5.6(C2) U3.5.7(C1)
M_GND: C3.1.1 C3.2.1 C3.3.1 C3.4.1 C3.5.2 C3.6.2 J3.1.1 J3.4.1 J3.5.1 J3.6.1 J3.7.1 R3.4.2 R3.5.2 R3.12.1 R3.13.2 U3.1.2(GND) U3.2.2(GND) U3.4.1(GND) U3.4.10(GND)
P_GND: Q3.1.1(S) Q3.2.1(S) Q3.3.1(S) Q3.4.1(S) R3.2.1 R3.7.1 R3.10.1 R3.16.1
ARM_SERV_BP_OUT: J3.3.3 R3.8.1
ARM_SERV_PWM: J3.2.2 Q3.6.3(S)
BOX_SERV_BP_OUT: J3.3.1 R3.15.1
BOX_SERV_PWM: J3.2.4 Q3.8.3(S)
BRIDGE_SERV_BP_OUT: J3.3.2 R3.9.1
BRIDGE_SERV_PWM: J3.2.1 Q3.7.3(S)
CLAW_SERV_BP_OUT: J3.3.4 R3.1.1
CLAW_SERV_PWM: J3.2.3 Q3.5.3(S)
NetQ3.1_2: Q3.1.2(G) R3.1.2 R3.2.2
NetQ3.1_3: Q3.1.3(D) U3.3.2(CAT1)
NetQ3.2_2: Q3.2.2(G) R3.7.2 R3.8.2
NetQ3.2_3: Q3.2.3(D) U3.3.3(CAT2)
NetQ3.3_2: Q3.3.2(G) R3.9.2 R3.10.2
NetQ3.3_3: Q3.3.3(D) U3.5.2(CAT1)
NetQ3.4_2: Q3.4.2(G) R3.15.2 R3.16.2
NetQ3.4_3: Q3.4.3(D) U3.5.3(CAT2)
NetQ3.5_1: Q3.5.1(G) U3.4.18(G1)
NetQ3.6_1: Q3.6.1(G) U3.4.16(G2)
NetQ3.7_1: Q3.7.1(G) U3.4.14(G3)
NetQ3.8_1: Q3.8.1(G) U3.4.12(G4)
NetR3.3_2: R3.3.2 U3.3.1(AN1)
NetR3.4_1: R3.4.1 U3.3.8(E1) U3.4.3(IN1)
NetR3.5_1: R3.5.1 U3.3.5(E2) U3.4.5(IN2)
NetR3.6_2: R3.6.2 U3.3.4(AN1)
NetR3.11_2: R3.11.2 U3.5.1(AN1)
NetR3.12_2: R3.12.2 U3.4.7(IN3) U3.5.8(E1)
NetR3.13_1: R3.13.1 U3.4.9(IN4) U3.5.5(E2)
NetR3.14_2: R3.14.2 U3.5.4(AN1)

Not connected (* = marked no-connect by the designer): U3.4 2(TIM1) 4(TIM2) 6(TIM3) 8(TIM4)

### Notes on the sheet
- Not using this schem and board
- 3 - Servos

### Library data of the parts
C3.1-C3.5 = Cap_Generic
C3.6 = Polarized Cap
J3.1 J3.4-J3.7 = 2pos Conn: 2pos Conn JST
J3.2 J3.3 = 4pos Conn
Q3.1-Q3.4 = VN2222LL NMOS: as Q2.1 on sheet Rear Motors; Supplier 1: Mouser; Supplier Part Number 1: 689-VN2222LL-G
Q3.5-Q3.8 = IRFZ44 NMOS: as Q2.5 on sheet Rear Motors; Supplier 1: Digi-Key; Supplier Part Number 1: IRFZ44ZLPBF-ND
R3.1-R3.16 = Res_Generic
U3.1 U3.2 = UA7805 5V Reg: UA7805 IC REG LINEAR 5V 1.5A TO220-3; Supplier 1: Digi-Key; Supplier Part Number 1: 296-39515-5-ND
U3.3 U3.5 = MCT6 Optocoupler: Optoisolator 5.3KV 2CH TRANS 8-DIP; Supplier 1: Mouser; Supplier Part Number 1: 512-MCT6
U3.4 = LT1161IN Gate Driver: as U2.2 on sheet Rear Motors; Supplier 1: Digi-Key; Supplier Part Number 1: LT1161IN#PBF-ND

## Sheet Reflectance (Single).SchDoc
size A4; SheetNumber: 6; SheetTotal: 6
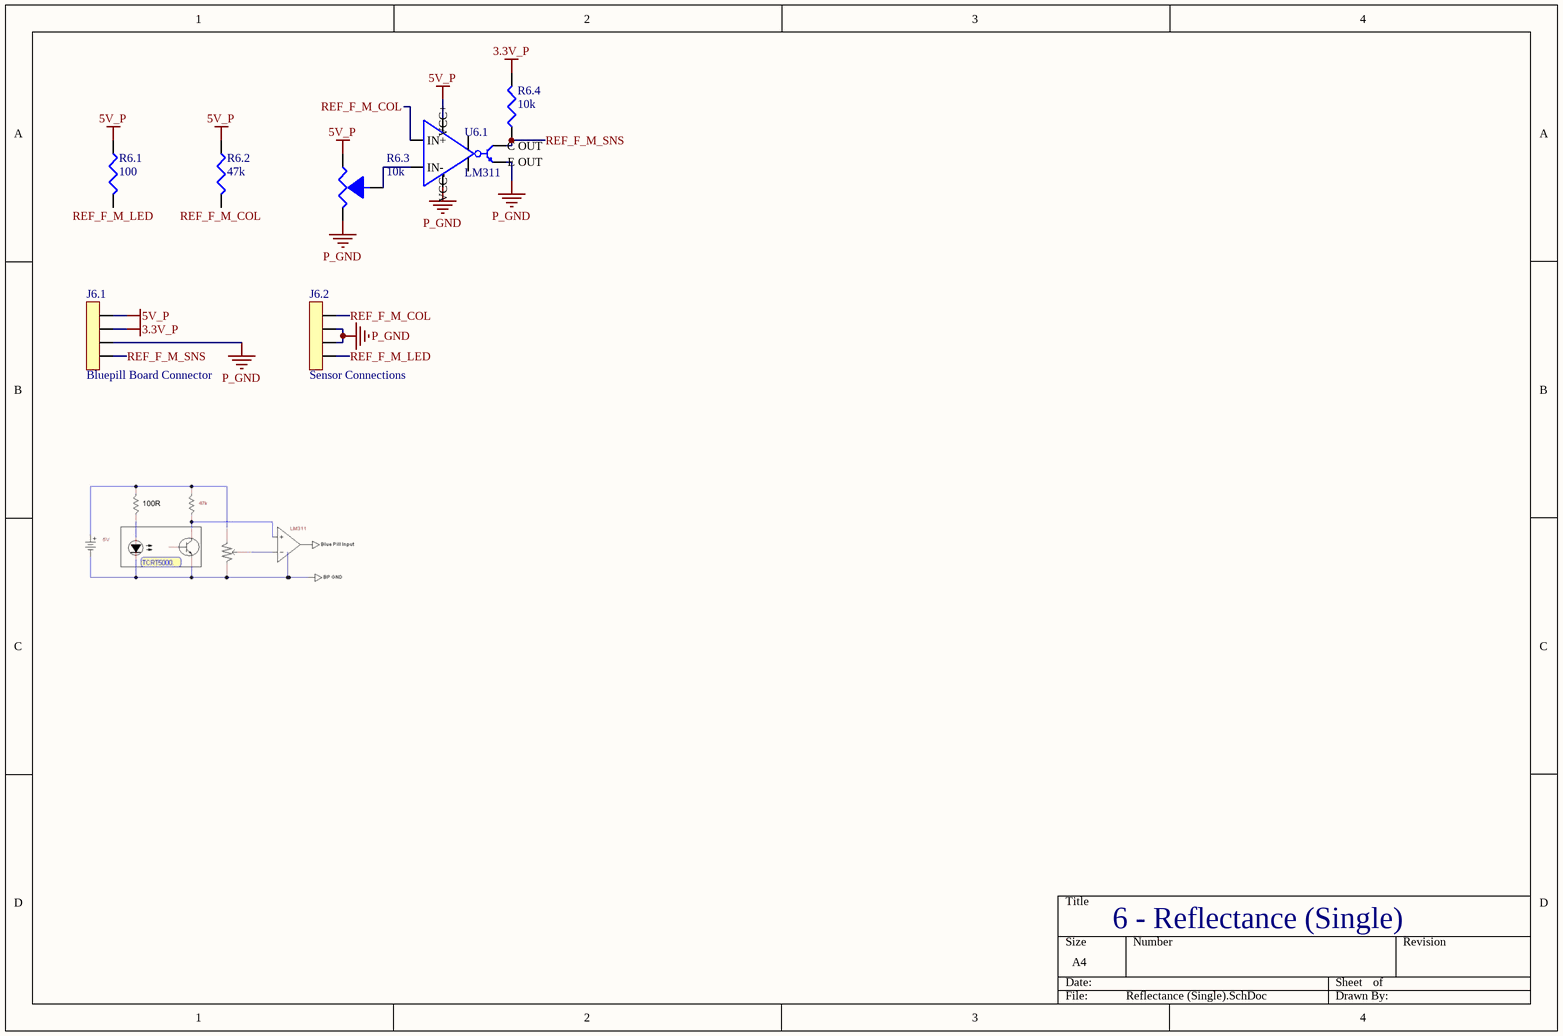
[diagram p5: Reflectance (Single).SchDoc]

### Parts
J6.1  Bluepill Board Connector  [4Pos JST]
J6.2  Sensor Connections  [4Pos JST]
R6.1  100  [Res_Generic]
R6.2  47k  [Res_Generic]
R6.3  10k  [Pot Generic]
R6.4  10k  [Res_Generic]
U6.1  LM311  [DIP8]

### Nets
3.3V_P: J6.1.3 R6.4.2
5V_P: J6.1.4 R6.1.1 R6.2.1 R6.3.3 U6.1.8(VCC+)
P_GND: J6.1.2 J6.2.2 J6.2.3 R6.3.1 U6.1.1(E_OUT) U6.1.4(VCC-)
REF_F_M_COL: J6.2.4 R6.2.2 U6.1.2(IN+)
REF_F_M_LED: J6.2.1 R6.1.2
REF_F_M_SNS: J6.1.1 R6.4.1 U6.1.7(C_OUT)
NetR6.3_2: R6.3.2 U6.1.3(IN-)

Not connected (* = marked no-connect by the designer): U6.1 5(BAL) 6(STRB)

### Notes on the sheet
- 6 - Reflectance (Single)

### Library data of the parts
J6.1 J6.2 = 4pos Conn
R6.1 R6.2 R6.4 = Res_Generic
R6.3 = Pot_Generic
U6.1 = LM311 Comparator: LM311 IC DIFF COMPARATOR STROBE 8-DIP; Supplier 1: Mouser; Supplier Part Number 1: 595-LM311P

## Sheet Gate Driver Chip.SchDoc
size A4; SheetNumber: 7; SheetTotal: 7
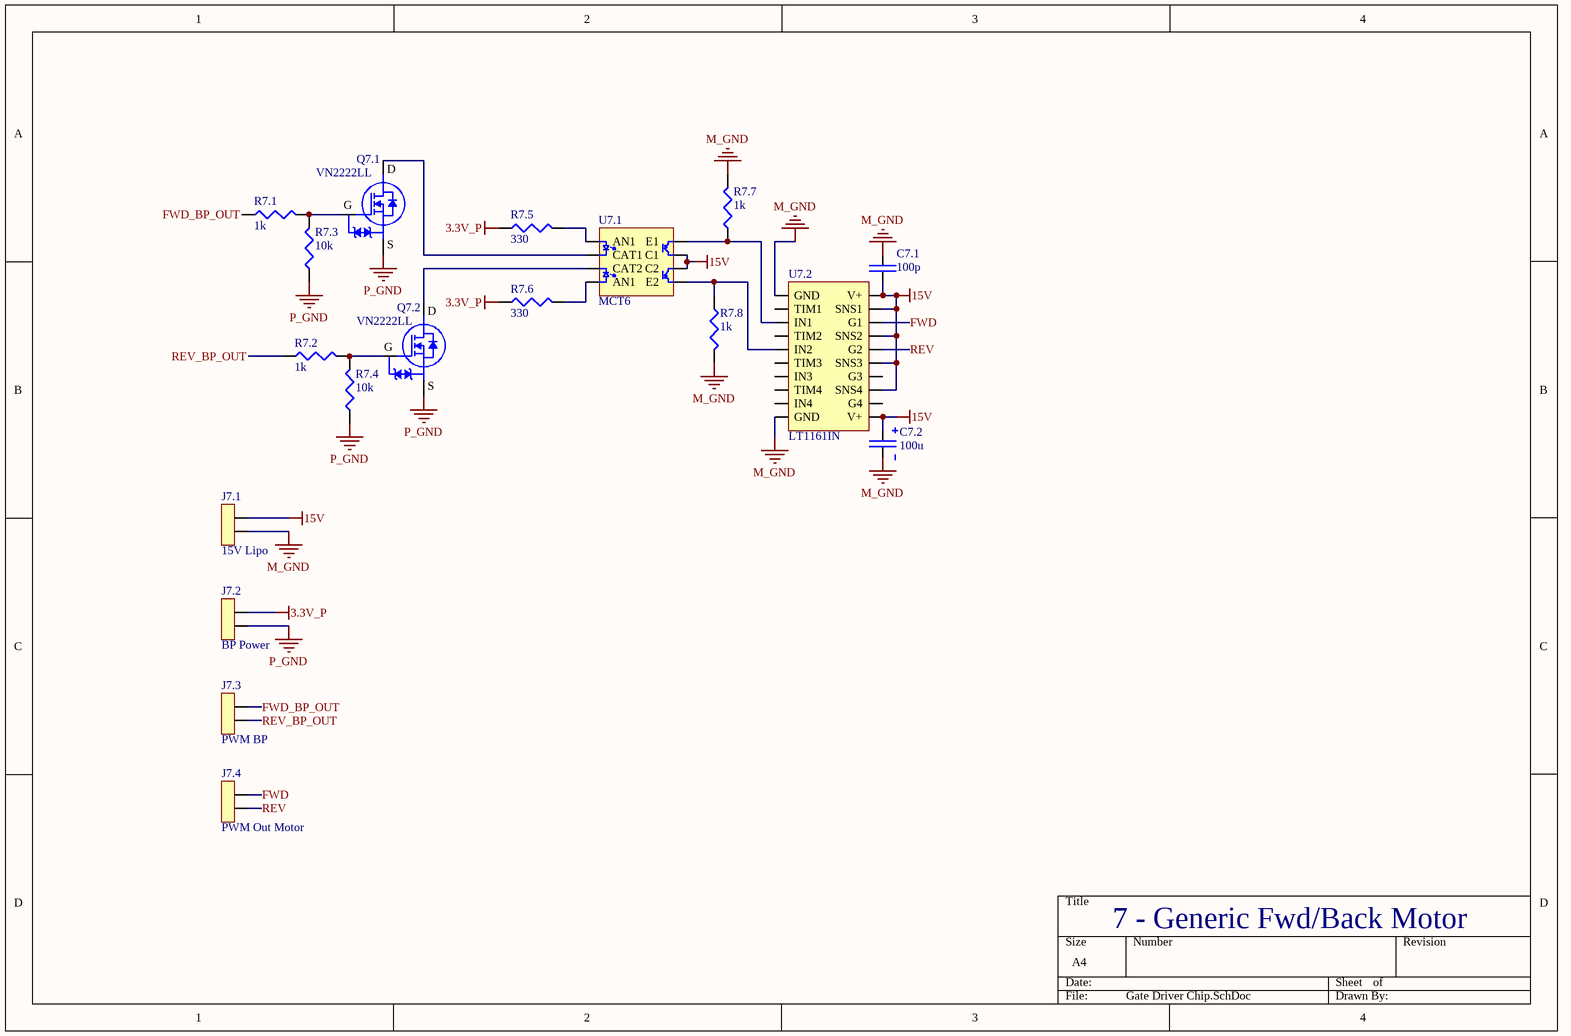
[diagram p6: Gate Driver Chip.SchDoc]

### Parts
C7.1  100p  [Non Polarized Cap]
C7.2  100u  [Polarized Cap]
J7.1  15V Lipo  [2pos JST]
J7.2  BP Power  [2pos JST]
J7.3  PWM BP  [2pos JST]
J7.4  PWM Out Motor  [2pos JST]
Q7.1  VN2222LL  [VN2222LL]
Q7.2  VN2222LL  [VN2222LL]
R7.1  1k  [Res_Generic]
R7.2  1k  [Res_Generic]
R7.3  10k  [Res_Generic]
R7.4  10k  [Res_Generic]
R7.5  330  [Res_Generic]
R7.6  330  [Res_Generic]
R7.7  1k  [Res_Generic]
R7.8  1k  [Res_Generic]
U7.1  MCT6  [DIP8]
U7.2  LT1161IN  [DIP20]

### Nets
3.3V_P: J7.2.2 R7.5.1 R7.6.1
15V: C7.1.1 C7.2.1 J7.1.2 U7.1.6(C2) U7.1.7(C1) U7.2.11(V+) U7.2.13(SNS4) U7.2.15(SNS3) U7.2.17(SNS2) U7.2.19(SNS1) U7.2.20(V+)
M_GND: C7.1.2 C7.2.2 J7.1.1 R7.7.2 R7.8.2 U7.2.1(GND) U7.2.10(GND)
P_GND: J7.2.1 Q7.1.1(S) Q7.2.1(S) R7.3.1 R7.4.1
FWD: J7.4.2 U7.2.18(G1)
FWD_BP_OUT: J7.3.2 R7.1.1
REV: J7.4.1 U7.2.16(G2)
REV_BP_OUT: J7.3.1 R7.2.1
NetQ7.1_2: Q7.1.2(G) R7.1.2 R7.3.2
NetQ7.1_3: Q7.1.3(D) U7.1.2(CAT1)
NetQ7.2_2: Q7.2.2(G) R7.2.2 R7.4.2
NetQ7.2_3: Q7.2.3(D) U7.1.3(CAT2)
NetR7.5_2: R7.5.2 U7.1.1(AN1)
NetR7.6_2: R7.6.2 U7.1.4(AN1)
NetR7.7_1: R7.7.1 U7.1.8(E1) U7.2.3(IN1)
NetR7.8_1: R7.8.1 U7.1.5(E2) U7.2.5(IN2)

Not connected (* = marked no-connect by the designer): U7.2 2(TIM1) 4(TIM2) 6(TIM3) 7(IN3) 8(TIM4) 9(IN4) 12(G4) 14(G3)

### Notes on the sheet
- 7 - Generic Fwd/Back Motor

### Library data of the parts
C7.1 = Cap_Generic
C7.2 = Polarized Cap
J7.1-J7.4 = 2pos Conn: 2pos Conn JST
Q7.1 Q7.2 = VN2222LL NMOS: as Q2.1 on sheet Rear Motors; Supplier 1: Mouser; Supplier Part Number 1: 689-VN2222LL-G
R7.1-R7.8 = Res_Generic
U7.1 = MCT6 Optocoupler: Optoisolator 5.3KV 2CH TRANS 8-DIP; Supplier 1: Mouser; Supplier Part Number 1: 512-MCT6
U7.2 = LT1161IN Gate Driver: as U2.2 on sheet Rear Motors; Supplier 1: Digi-Key; Supplier Part Number 1: LT1161IN#PBF-ND

## Sheet Motor Driver (Single).SchDoc
size A4; SheetNumber: 8; SheetTotal: 8
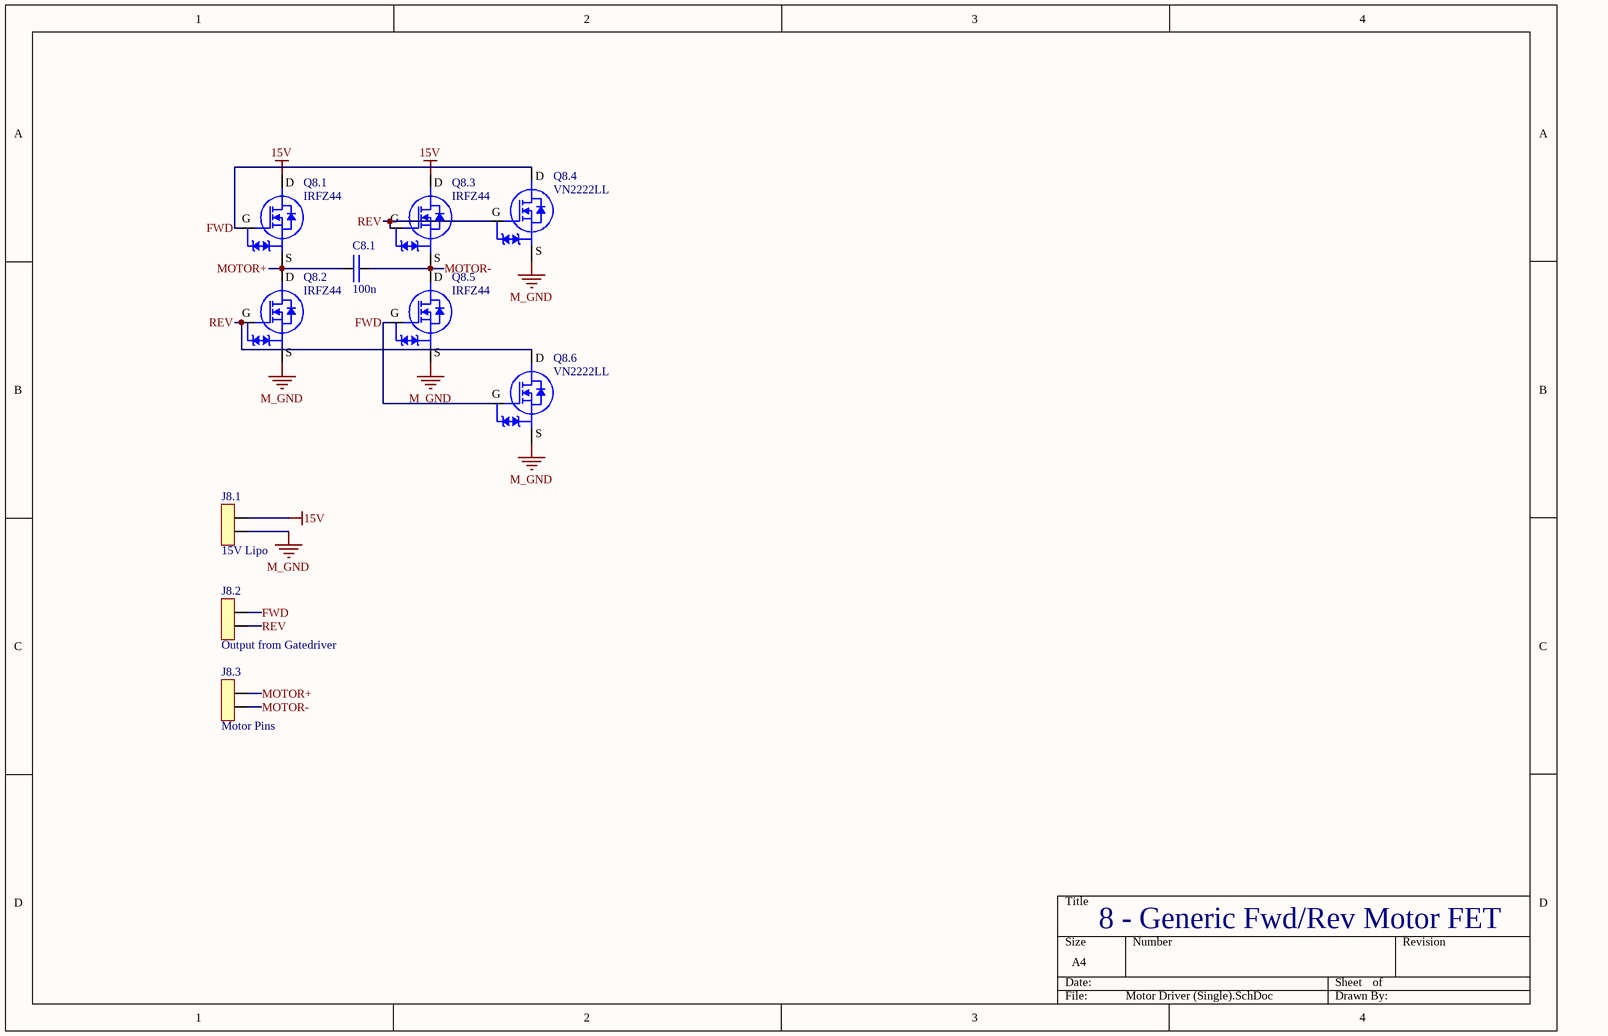
[diagram p7: Motor Driver (Single).SchDoc]

### Parts
C8.1  100n  [Non Polarized Cap]
J8.1  15V Lipo  [2pos JST]
J8.2  Output from Gatedriver  [2pos JST]
J8.3  Motor Pins  [2pos JST]
Q8.1  IRFZ44  [TO220]
Q8.2  IRFZ44  [TO220]
Q8.3  IRFZ44  [TO220]
Q8.4  VN2222LL  [VN2222LL]
Q8.5  IRFZ44  [TO220]
Q8.6  VN2222LL  [VN2222LL]

### Nets
15V: J8.1.2 Q8.1.2(D) Q8.3.2(D)
M_GND: J8.1.1 Q8.2.3(S) Q8.4.1(S) Q8.5.3(S) Q8.6.1(S)
FWD: J8.2.2 Q8.1.1(G) Q8.4.3(D) Q8.5.1(G) Q8.6.2(G)
MOTOR+: C8.1.1 J8.3.2 Q8.1.3(S) Q8.2.2(D)
MOTOR-: C8.1.2 J8.3.1 Q8.3.3(S) Q8.5.2(D)
REV: J8.2.1 Q8.2.1(G) Q8.3.1(G) Q8.4.2(G) Q8.6.3(D)

### Notes on the sheet
- 8 - Generic Fwd/Rev Motor FET

### Library data of the parts
C8.1 = Cap_Generic
J8.1 = 2pos Conn: 2pos Conn JST
J8.2 J8.3 = 2pos Conn
Q8.1-Q8.3 Q8.5 = IRFZ44 NMOS: as Q2.5 on sheet Rear Motors; Supplier 1: Digi-Key; Supplier Part Number 1: IRFZ44ZLPBF-ND
Q8.4 Q8.6 = VN2222LL NMOS: as Q2.1 on sheet Rear Motors; Supplier 1: Mouser; Supplier Part Number 1: 689-VN2222LL-G

## Sheet Servo Opto.SchDoc
size A4; SheetNumber: 9; SheetTotal: 9
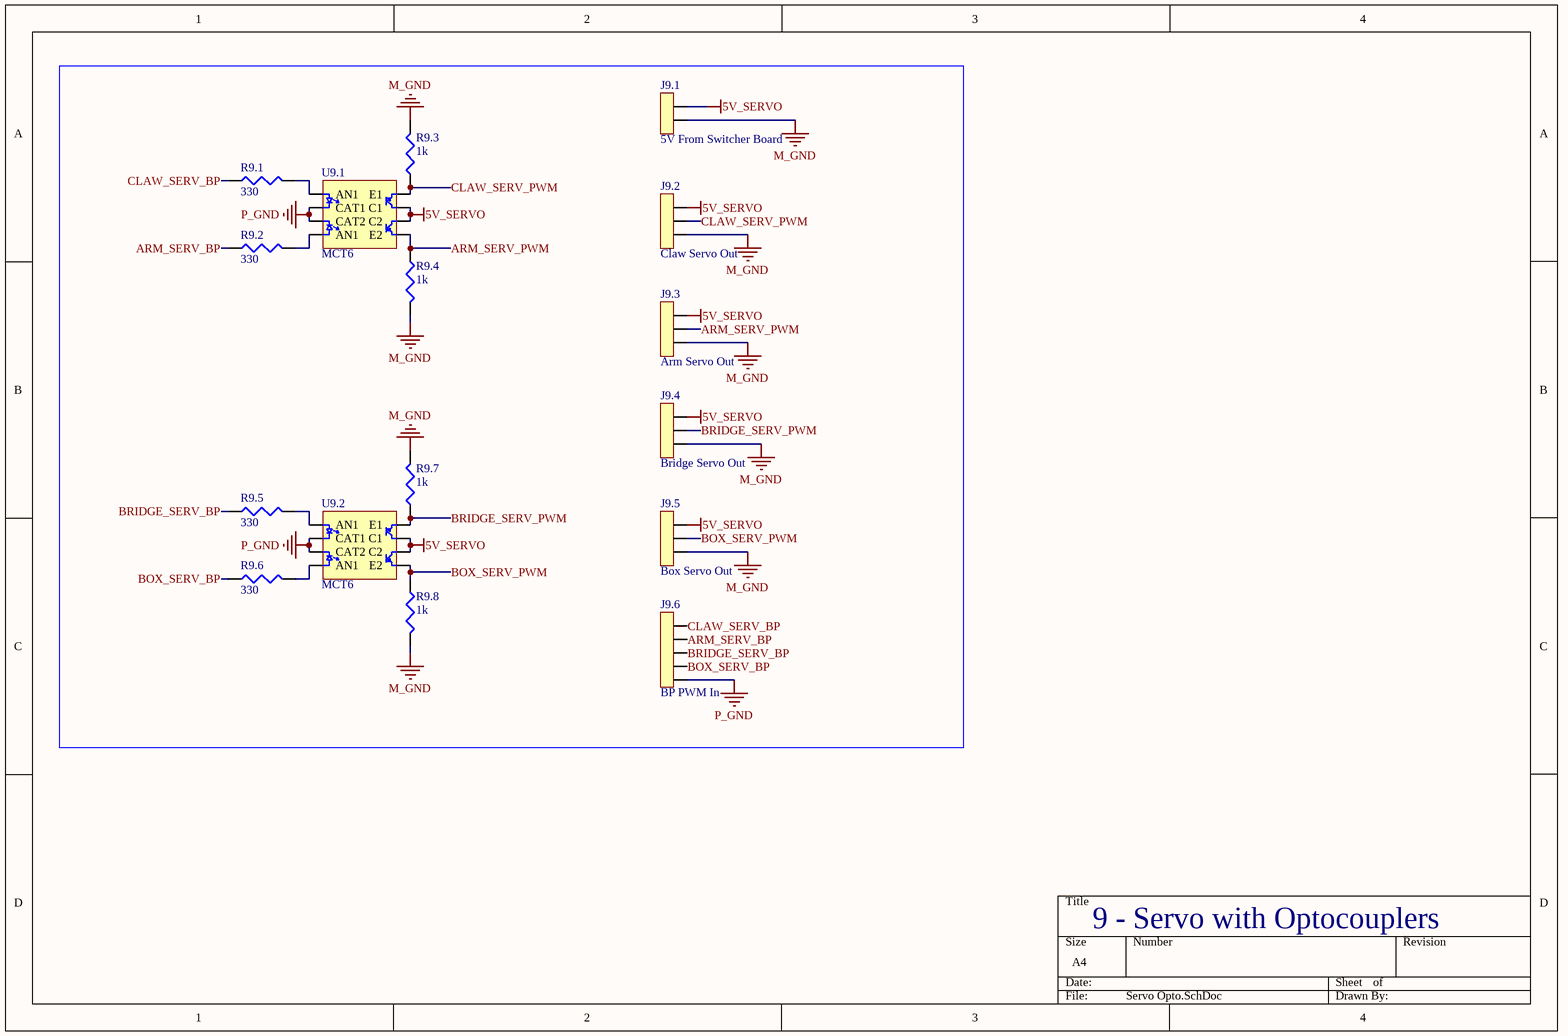
[diagram p8: Servo Opto.SchDoc]

### Parts
J9.1  5V From Switcher Board  [2pos JST]
J9.2  Claw Servo Out  [3pos JST]
J9.3  Arm Servo Out  [3pos JST]
J9.4  Bridge Servo Out  [3pos JST]
J9.5  Box Servo Out  [3pos JST]
J9.6  BP PWM In  [5POS JST]
R9.1  330  [Res_Generic]
R9.2  330  [Res_Generic]
R9.3  1k  [Res_Generic]
R9.4  1k  [Res_Generic]
R9.5  330  [Res_Generic]
R9.6  330  [Res_Generic]
R9.7  1k  [Res_Generic]
R9.8  1k  [Res_Generic]
U9.1  MCT6  [DIP8]
U9.2  MCT6  [DIP8]

### Nets
5V_SERVO: J9.1.2 J9.2.3 J9.3.3 J9.4.3 J9.5.3 U9.1.6(C2) U9.1.7(C1) U9.2.6(C2) U9.2.7(C1)
M_GND: J9.1.1 J9.2.1 J9.3.1 J9.4.1 J9.5.1 R9.3.2 R9.4.2 R9.7.2 R9.8.2
P_GND: J9.6.5 U9.1.2(CAT1) U9.1.3(CAT2) U9.2.2(CAT1) U9.2.3(CAT2)
ARM_SERV_BP: J9.6.3 R9.2.1
ARM_SERV_PWM: J9.3.2 R9.4.1 U9.1.5(E2)
BOX_SERV_BP: J9.6.1 R9.6.1
BOX_SERV_PWM: J9.5.2 R9.8.1 U9.2.5(E2)
BRIDGE_SERV_BP: J9.6.2 R9.5.1
BRIDGE_SERV_PWM: J9.4.2 R9.7.1 U9.2.8(E1)
CLAW_SERV_BP: J9.6.4 R9.1.1
CLAW_SERV_PWM: J9.2.2 R9.3.1 U9.1.8(E1)
NetR9.1_2: R9.1.2 U9.1.1(AN1)
NetR9.2_2: R9.2.2 U9.1.4(AN1)
NetR9.5_2: R9.5.2 U9.2.1(AN1)
NetR9.6_2: R9.6.2 U9.2.4(AN1)

### Notes on the sheet
- 9 - Servo with Optocouplers

### Library data of the parts
J9.1 = 2pos Conn: 2pos Conn JST
J9.2-J9.5 = 3pos Conn
J9.6 = 5pos Conn: 5pos Conn JST
R9.1-R9.8 = Res_Generic
U9.1 U9.2 = MCT6 Optocoupler: Optoisolator 5.3KV 2CH TRANS 8-DIP; Supplier 1: Mouser; Supplier Part Number 1: 512-MCT6

## Nets that join several sheets
3.3V_P: Bluepill and Power (12 pins), IR (J5.1.2 J5.2.2 J5.3.3 R5.6.2), Reflectance (6 pins), Rear Motors (5 pins), Servos (R3.3.1 R3.6.1 R3.11.1 R3.14.1), Reflectance (Single) (J6.1.3 R6.4.2), Gate Driver Chip (J7.2.2 R7.5.1 R7.6.1)
5V_P: Bluepill and Power (6 pins), IR (J5.3.2 R5.3.2 U5.1.8), Reflectance (21 pins), Reflectance (Single) (5 pins)
5V_SERVO: Servos (8 pins), Servo Opto (9 pins)
15V: Rear Motors (17 pins), Servos (17 pins), Gate Driver Chip (11 pins), Motor Driver (Single) (J8.1.2 Q8.1.2 Q8.3.2)
M_GND: Rear Motors (17 pins), Servos (19 pins), Gate Driver Chip (7 pins), Motor Driver (Single) (5 pins), Servo Opto (9 pins)
P_GND: Bluepill and Power (23 pins), IR (7 pins), Reflectance (16 pins), Rear Motors (9 pins), Servos (8 pins), Reflectance (Single) (6 pins), Gate Driver Chip (5 pins), Servo Opto (5 pins)
ARM_SERV_BP_OUT: Bluepill and Power (J1.18.3 U1.1.26), Servos (J3.3.3 R3.8.1)
ARM_SERV_PWM: Servos (J3.2.2 Q3.6.3), Servo Opto (J9.3.2 R9.4.1 U9.1.5)
BOX_SERV_BP_OUT: Bluepill and Power (J1.18.1 U1.1.7), Servos (J3.3.1 R3.15.1)
BOX_SERV_PWM: Servos (J3.2.4 Q3.8.3), Servo Opto (J9.5.2 R9.8.1 U9.2.5)
BRIDGE_SERV_BP_OUT: Bluepill and Power (J1.18.2 U1.1.27), Servos (J3.3.2 R3.9.1)
BRIDGE_SERV_PWM: Servos (J3.2.1 Q3.7.3), Servo Opto (J9.4.2 R9.7.1 U9.2.8)
CLAW_SERV_BP_OUT: Bluepill and Power (J1.18.4 U1.1.25), Servos (J3.3.4 R3.1.1)
CLAW_SERV_PWM: Servos (J3.2.3 Q3.5.3), Servo Opto (J9.2.2 R9.3.1 U9.1.8)
FWD: Gate Driver Chip (J7.4.2 U7.2.18), Motor Driver (Single) (5 pins)
IR_SNS_LEFT: Bluepill and Power (J1.19.2 U1.1.9), IR (J5.4.1)
IR_SNS_RIGHT: Bluepill and Power (J1.19.1 U1.1.10), IR (5 pins)
LEFT_FWD_BP_OUT: Bluepill and Power (J1.10.2 U1.1.34), Rear Motors (J2.3.1 R2.9.1)
LEFT_REV_BP_OUT: Bluepill and Power (J1.10.1 U1.1.35), Rear Motors (J2.3.2 R2.11.1)
REF_F_L_SNS: Bluepill and Power (J1.20.2 U1.1.13), Reflectance (J4.1.2 R4.14.1 U4.2.7)
REF_F_R_SNS: Bluepill and Power (J1.20.1 U1.1.14), Reflectance (J4.1.1 R4.12.1 U4.1.7)
REF_R_SNS: Bluepill and Power (J1.20.5 U1.1.8), Reflectance (J4.1.5 R4.18.1 U4.4.7)
REF_S_L_SNS: Bluepill and Power (J1.20.4 U1.1.11), Reflectance (J4.1.4 R4.20.1 U4.5.7)
REF_S_R_SNS: Bluepill and Power (J1.20.3 U1.1.12), Reflectance (J4.1.3 R4.16.1 U4.3.7)
REV: Gate Driver Chip (J7.4.1 U7.2.16), Motor Driver (Single) (5 pins)
RIGHT_FWD_BP_OUT: Bluepill and Power (J1.9.2 U1.1.36), Rear Motors (J2.2.1 R2.1.1)
RIGHT_REV_BP_OUT: Bluepill and Power (J1.9.1 U1.1.37), Rear Motors (J2.2.2 R2.4.1)